# EAGLE design Base_Board_v1.1b (EAGLE 6.4)

## Sheet 1 of 3
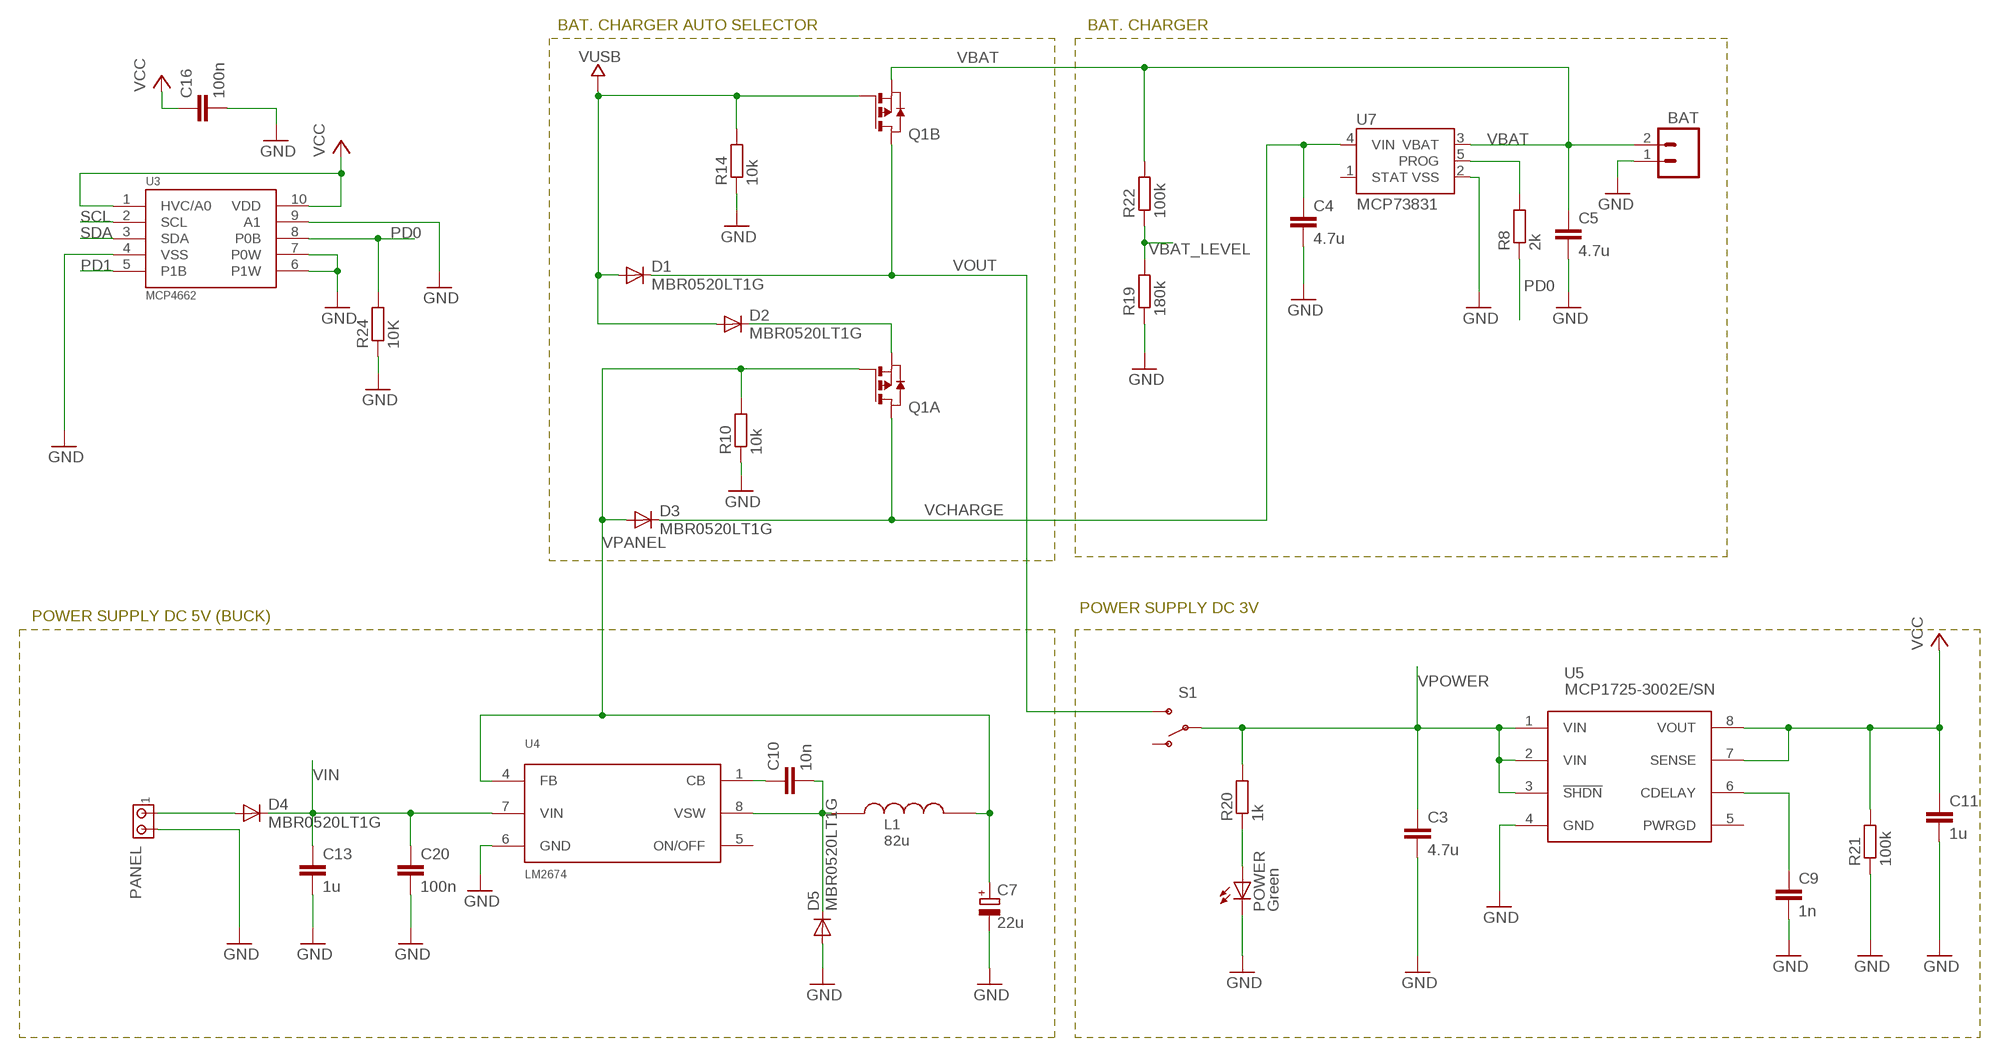
[diagram p0: schematic, sheet 1]

### Parts
BAT  M02-JST-2MM-SMT  [S2B-PH]
C3  4.7u  C-EUC0805  [C0805]
C4  4.7u  C-EUC0805  [C0805]
C5  4.7u  C-EUC0805  [C0805]
C7  22u  CPOL-EUSMCA  [SMC_A]
C9  1n  C-EUC0603K  [C0603K]
C10  10n  C-EUC0603K  [C0603K]
C11  1u  C-EUC0805  [C0805]
C13  1u  C-EUC0805  [C0805]
C16  100n  C-EUC0603K  [C0603K]
C20  100n  C-EUC0603K  [C0603K]
D1  MBR0520LT1G  DIODE-SOD123  [SOD123]
D2  MBR0520LT1G  DIODE-SOD123  [SOD123]
D3  MBR0520LT1G  DIODE-SOD123  [SOD123]
D4  MBR0520LT1G  DIODE-SOD123  [SOD123]
D5  MBR0520LT1G  DIODE-SOD123  [SOD123]
L1  82u  LSDR1006  [SDR1006]
PANEL  MTA02-100  [10X02MTA]
POWER  Green  LEDCHIP-LED0805  [CHIP-LED0805]
Q1  PMOS2SO8  [SO8]
R8  2k  R-EU_R0603  [R0603]
R10  10k  R-EU_R0603  [R0603]
R14  10k  R-EU_R0603  [R0603]
R19  180k  R-EU_R0603  [R0603]
R20  1k  R-EU_R0603  [R0603]
R21  100k  R-EU_R0603  [R0603]
R22  100k  R-EU_R0603  [R0603]
R24  10K  R-EU_R0603  [R0603]
S1  SWITCH-SPST-SMD-A  [SWITCH-SPST-SMD-A]
U3  MCP4662  [MSOP10]
U4  LM2674  [SO8]
U5  MCP1725-3002E/SN  MCP1725  [SOIC8]
U7  MCP73831  [SOT23-5]

### Nets
GND: BAT.1 C3.2 C4.2 C5.2 C7.- C9.2 C11.2 C13.2 C16.2 C20.2 D5.A PANEL.2 POWER.C R10.1 R14.1 R19.1 R21.1 R24.1 U3.4(VSS) U3.6(P1W) U3.7(P0W) U3.9(A1) U4.6(GND) U5.4(GND) U7.2(VSS) ; also sheet 2,3
N$1: D2.C Q1.1(A:S)
N$3 [power]: D4.A PANEL.1
N$9: C9.1 U5.6(CDELAY)
N$13: R8.2 U7.5(PROG)
N$20: POWER.A R20.1
N$47: C10.1 U4.1(CB)
N$54 [power]: C10.2 D5.C L1.1 U4.8(VSW)
PD0: R8.1 R24.2 U3.8(P0B)
PD1: U3.5(P1B)
SCL: U3.2(SCL) ; also sheet 2,3
SDA: U3.3(SDA) ; also sheet 2,3
VBAT [power]: BAT.2 C5.1 Q1.3(B:S) R22.2 U7.3(VBAT)
VBAT_LEVEL: R19.2 R22.1 ; also sheet 2
VCC [power]: C11.1 C16.1 R21.2 U3.1(HVC/A0) U3.10(VDD) U5.7(SENSE) U5.8(VOUT) ; also sheet 2,3
VCHARGE [power]: C4.1 D3.C Q1.7(A:D) Q1.8(A:D) U7.4(VIN)
VIN [power]: C13.1 C20.1 D4.C U4.7(VIN) ; also sheet 3
VOUT [power]: D1.C Q1.5(B:D) Q1.6(B:D) S1.3(S)
VPANEL [power]: C7.+ D3.A L1.2 Q1.2(A:G) R10.2 U4.4(FB)
VPOWER [power]: C3.1 R20.2 S1.2(P) U5.1(VIN) U5.2(VIN) U5.3(!SHDN) ; also sheet 2
VUSB [power]: D1.A D2.A Q1.4(B:G) R14.2 ; also sheet 2
Unconnected: S1.1(O) U4.5(ON/OFF) U5.5(PWRGD) U7.1(STAT)

### Notes on the sheet
- BAT. CHARGER AUTO SELECTOR | BAT. CHARGER
- POWER SUPPLY DC 3V
- POWER SUPPLY DC 5V (BUCK)

## Sheet 2 of 3
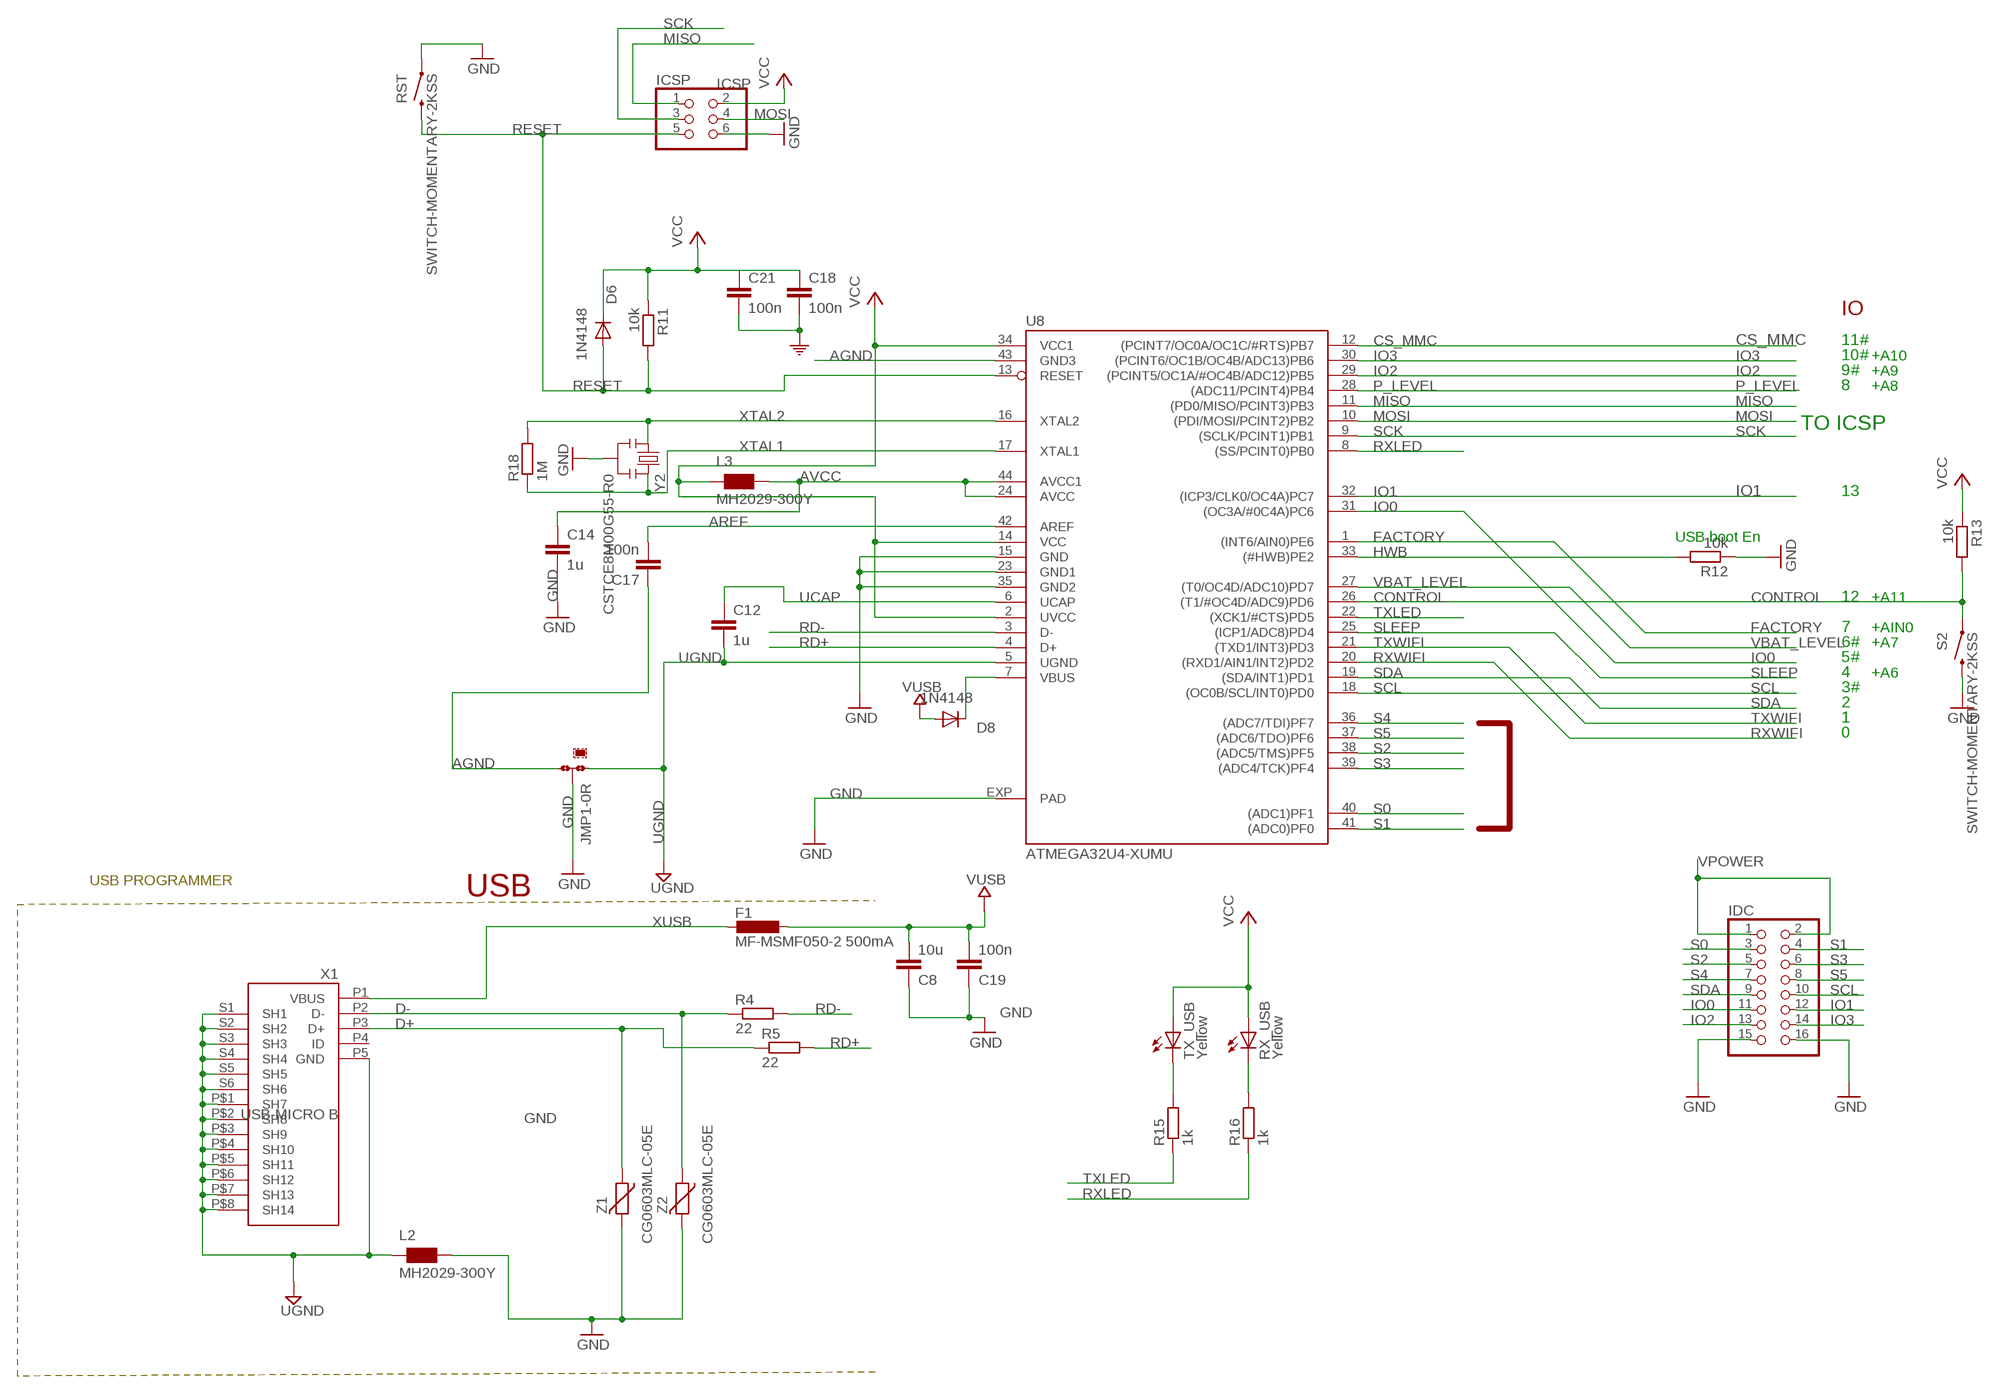
[diagram p1: schematic, sheet 2]

### Parts
C8  10u  C-EUC0805  [C0805]
C12  1u  C-EUC0805  [C0805]
C14  1u  C-EUC0805  [C0805]
C17  100n  C-EUC0603K  [C0603K]
C18  100n  C-EUC0603K  [C0603K]
C19  100n  C-EUC0603K  [C0603K]
C21  100n  C-EUC0603K  [C0603K]
D6  1N4148  DIODE-SOD323-W  [SOD323-W]
D8  1N4148  DIODE-SOD323-W  [SOD323-W]
F1  MF-MSMF050-2 500mA  L-EUL1812  [L1812]
ICSP  ICSP  PINHD-2X3  [2X03]
IDC  PINHD-2X8  [2X08]
JMP1  0R-JUMPC  [C0R-JMP]
L2  MH2029-300Y  WE-CBF_0805  [0805]
L3  MH2029-300Y  WE-CBF_0805  [0805]
R4  22  R-EU_R0603  [R0603]
R5  22  R-EU_R0603  [R0603]
R11  10k  R-EU_R0603  [R0603]
R12  10k  R-EU_R0603  [R0603]
R13  10k  R-EU_R0603  [R0603]
R15  1k  R-EU_R0603  [R0603]
R16  1k  R-EU_R0603  [R0603]
R18  1M  R-EU_R0603  [R0603]
RST  SWITCH-MOMENTARY-2KSS  [KSS241G]
RX_USB  Yellow  LEDCHIP-LED0805  [CHIP-LED0805]
S2  SWITCH-MOMENTARY-2KSS  [KSS241G]
TX_USB  Yellow  LEDCHIP-LED0805  [CHIP-LED0805]
U8  ATMEGA32U4-XUMU  [QFN44ML7X7]
X1  USB-MICRO B  MYCON2_USB-MINI-B  [CON2_USB_MICRO_B_AT]
Y2  CSTCE8M00G55-R0  [CSTCE8M00G55-R0]
Z1  CG0603MLC-05E  VARISTORCN0603  [CT/CN0603]
Z2  CG0603MLC-05E  VARISTORCN0603  [CT/CN0603]

### Nets
AGND: C17.1 JMP1.3 U8.43(GND3)
AREF [aref]: C17.2 U8.42(AREF)
AVCC: C14.1 L3.2 U8.24(AVCC) U8.44(AVCC1)
CONTROL: R13.2 S2.1 U8.26((T1/#OC4D/ADC9)PD6)
CS_MMC: U8.12((PCINT7/OC0A/OC1C/#RTS)PB7) ; also sheet 3
D+: R5.1 X1.P3(D+) Z1.1
D-: R4.1 X1.P2(D-) Z2.1
FACTORY: U8.1((INT6/AIN0)PE6) ; also sheet 3
GND: C8.1 C14.2 C18.2 C19.1 C21.2 ICSP.6 IDC.15 IDC.16 JMP1.2 L2.2 R12.1 RST.1 S2.2 U8.15(GND) U8.23(GND1) U8.35(GND2) U8.EXP(PAD) Y2.2 Z1.2 Z2.2 ; supply symbol labelled COM ; also sheet 1,3
GND1: L2.1 X1.P5(GND) X1.P$1(SH7) X1.P$2(SH8) X1.P$3(SH9) X1.P$4(SH10) X1.P$5(SH11) X1.P$6(SH12) X1.P$7(SH13) X1.P$8(SH14) X1.S1(SH1) X1.S2(SH2) X1.S3(SH3) X1.S4(SH4) X1.S5(SH5) X1.S6(SH6) ; supply symbol labelled UGND
HWB: R12.2 U8.33((#HWB)PE2)
IO0: IDC.11 U8.31((OC3A/#0C4A)PC6)
IO1: IDC.12 U8.32((ICP3/CLK0/OC4A)PC7)
IO2: IDC.13 U8.29((PCINT5/OC1A/#OC4B/ADC12)PB5)
IO3: IDC.14 U8.30((PCINT6/OC1B/OC4B/ADC13)PB6)
MISO: ICSP.1 U8.11((PD0/MISO/PCINT3)PB3) ; also sheet 3
MOSI: ICSP.4 U8.10((PDI/MOSI/PCINT2)PB2) ; also sheet 3
N$2 [usbvcc]: R15.2 TX_USB.C
N$4 [usbvcc]: R16.2 RX_USB.C
N$5 [power]: D8.C U8.7(VBUS)
P_LEVEL: U8.28((ADC11/PCINT4)PB4) ; also sheet 3
RD+: R5.2 U8.4(D+)
RD-: R4.2 U8.3(D-)
RESET: D6.A ICSP.5 R11.2 RST.2 U8.13(RESET) ; also sheet 3
RXLED: R16.1 U8.8((SS/PCINT0)PB0)
RXWIFI: U8.20((RXD1/AIN1/INT2)PD2) ; also sheet 3
S0: IDC.3 U8.40((ADC1)PF1)
S1: IDC.4 U8.41((ADC0)PF0)
S2: IDC.5 U8.38((ADC5/TMS)PF5)
S3: IDC.6 U8.39((ADC4/TCK)PF4)
S4: IDC.7 U8.36((ADC7/TDI)PF7)
S5: IDC.8 U8.37((ADC6/TDO)PF6)
SCK: ICSP.3 U8.9((SCLK/PCINT1)PB1) ; also sheet 3
SCL: IDC.10 U8.18((OC0B/SCL/INT0)PD0) ; also sheet 1,3
SDA: IDC.9 U8.19((SDA/INT1)PD1) ; also sheet 1,3
SLEEP: U8.25((ICP1/ADC8)PD4) ; also sheet 3
TXLED: R15.1 U8.22((XCK1/#CTS)PD5)
TXWIFI: U8.21((TXD1/INT3)PD3) ; also sheet 3
UCAP: C12.1 U8.6(UCAP)
UGND [gnd]: C12.2 JMP1.1 U8.5(UGND)
VBAT_LEVEL: U8.27((T0/OC4D/ADC10)PD7) ; also sheet 1
VCC [power]: C18.1 C21.1 D6.C ICSP.2 L3.1 R11.1 R13.1 RX_USB.A TX_USB.A U8.2(UVCC) U8.14(VCC) U8.34(VCC1) ; also sheet 1,3
VPOWER [power]: IDC.1 IDC.2 ; also sheet 1
VUSB [power]: C8.2 C19.2 D8.A F1.1 ; also sheet 1
XTAL1: R18.1 U8.17(XTAL1) Y2.3
XTAL2: R18.2 U8.16(XTAL2) Y2.1
XUSB [usbvcc]: F1.2 X1.P1(VBUS)
Unconnected: X1.P4(ID)

### Notes on the sheet
- IO
- 11#
- 10# | +A10
- 9# | +A9
- 8 | +A8
- TO ICSP
- 13
- USB boot En
- 12 | +A11
- 7 | +AIN0
- 6# | +A7
- 5#
- 4 | +A6
- 3#
- 2
- 1
- 0
- USB PROGRAMMER
- USB

## Sheet 3 of 3
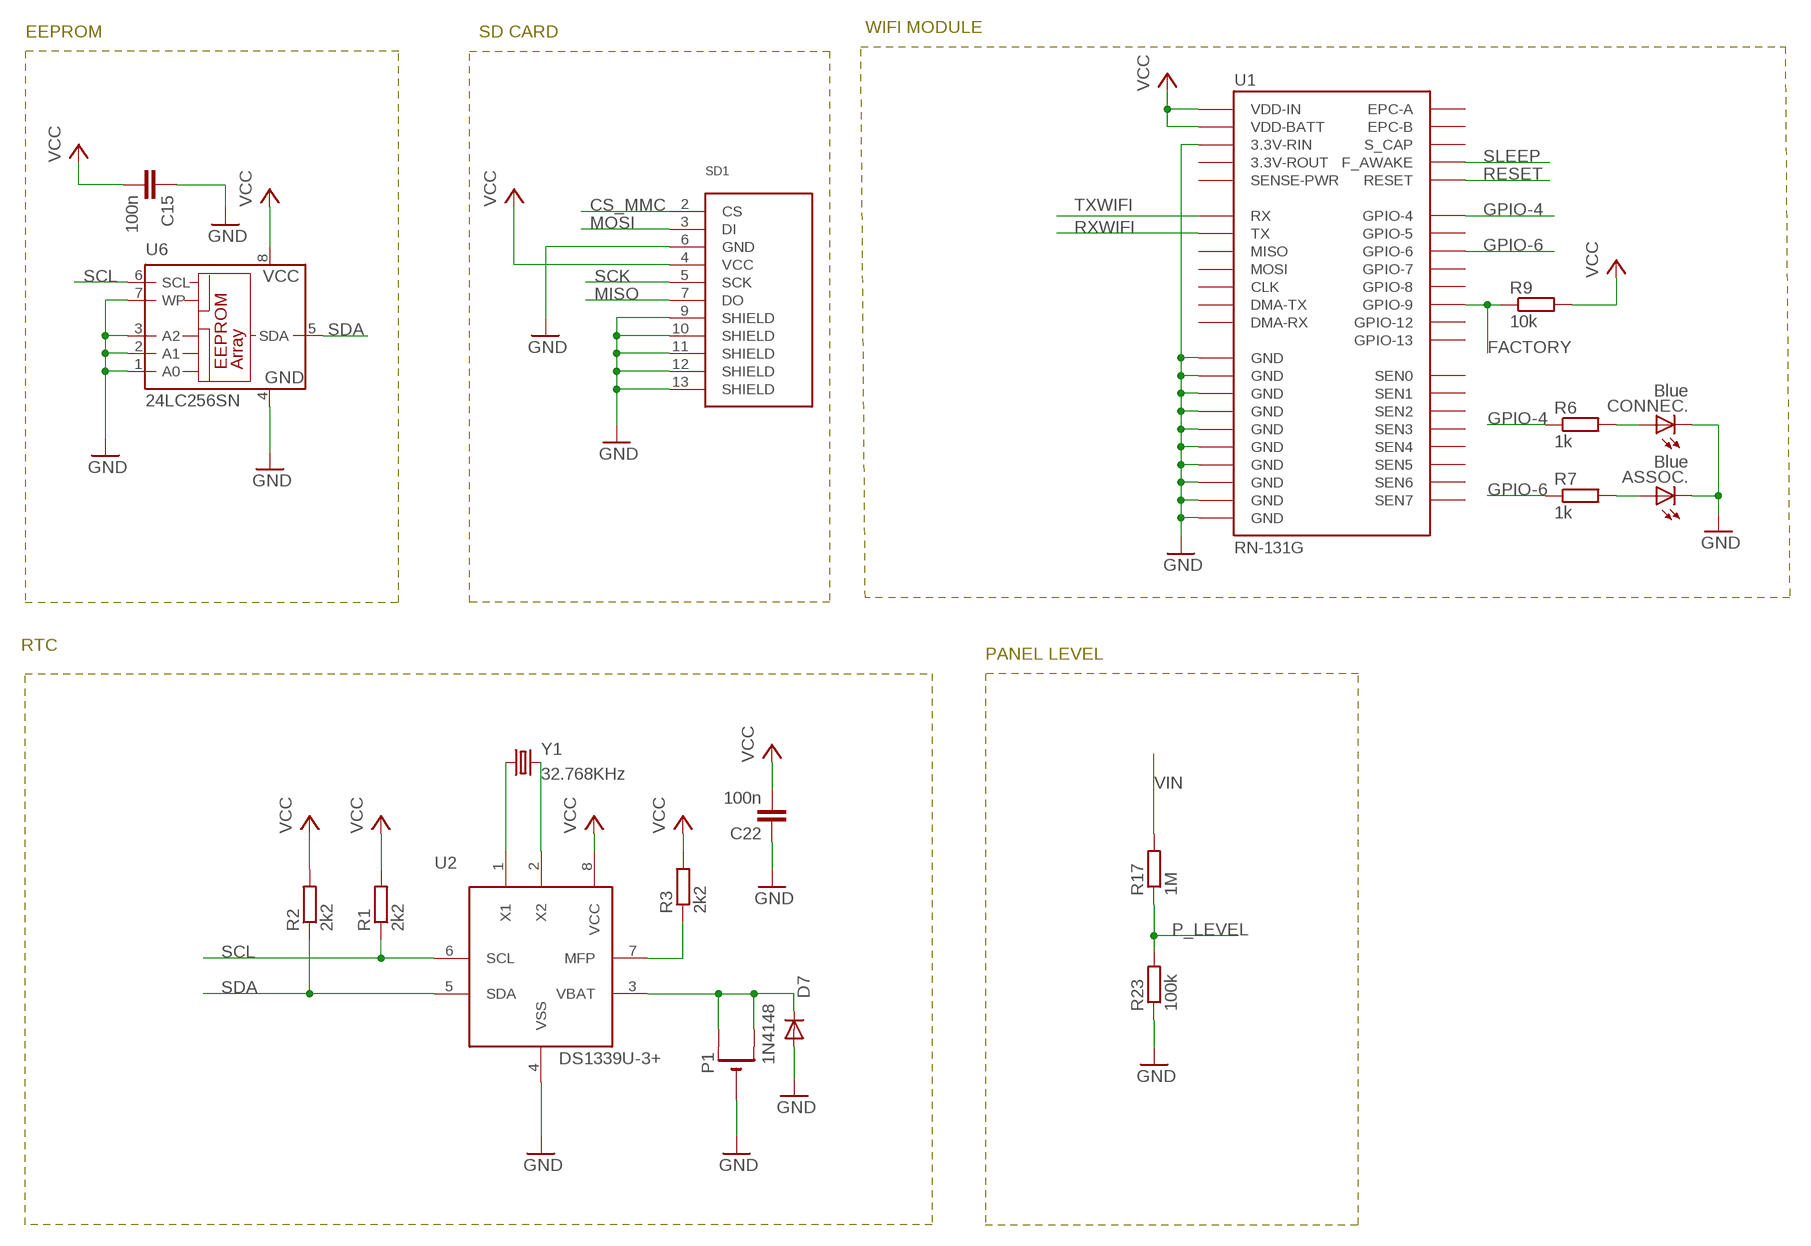
[diagram p2: schematic, sheet 3]

### Parts
ASSOC.  Blue  LEDCHIP-LED0805  [CHIP-LED0805]
C15  100n  C-EUC0603K  [C0603K]
C22  100n  C-EUC0603K  [C0603K]
CONNEC.  Blue  LEDCHIP-LED0805  [CHIP-LED0805]
D7  1N4148  DIODE-SOD323-W  [SOD323-W]
P1  CR1220SMT  [CR1220-SMD]
R1  2k2  R-EU_R0603  [R0603]
R2  2k2  R-EU_R0603  [R0603]
R3  2k2  R-EU_R0603  [R0603]
R6  1k  R-EU_R0603  [R0603]
R7  1k  R-EU_R0603  [R0603]
R9  10k  R-EU_R0603  [R0603]
R17  1M  R-EU_R0603  [R0603]
R23  100k  R-EU_R0603  [R0603]
SD1  SD_CARD_SOCKETDM3CS  [DM3CS]
U1  RN-131G  [RN-131G]
U2  DS1339U-3+  MCP7940N-I/MS  [MSOP-8]
U6  24LC256SN  [SO-08]
Y1  32.768KHz  CRYSTALABS10  [ABS10]

### Nets
CS_MMC: SD1.2(CS) ; also sheet 2
FACTORY: R9.1 U1.P$24(GPIO-9) ; also sheet 2
GND: ASSOC..C C15.1 C22.1 CONNEC..C D7.A P1.- R23.1 SD1.6(GND) SD1.9(SHIELD) SD1.10(SHIELD) SD1.11(SHIELD) SD1.12(SHIELD) SD1.13(SHIELD) U1.P$18(3.3V-RIN) U1.P$19(GND) U1.P$36(GND) U1.P$37(GND) U1.P$38(GND) U1.P$39(GND) U1.P$40(GND) U1.P$41(GND) U1.P$42(GND) U1.P$43(GND) U1.P$44(GND) U2.4(VSS) U6.1(A0) U6.2(A1) U6.3(A2) U6.4(GND) U6.7(WP) ; also sheet 1,2
GPIO-4: R6.1 U1.P$29(GPIO-4)
GPIO-6: R7.1 U1.P$27(GPIO-6)
MISO: SD1.7(DO) ; also sheet 2
MOSI: SD1.3(DI) ; also sheet 2
N$6: ASSOC..A R7.2
N$7: R3.1 U2.7(MFP)
N$8: CONNEC..A R6.2
N$16: U2.1(X1) Y1.1
N$17: U2.2(X2) Y1.2
N$18: D7.C P1.+$1(+) P1.+$2(+1) U2.3(VBAT)
P_LEVEL: R17.1 R23.2 ; also sheet 2
RESET: U1.P$5(RESET) ; also sheet 2
RXWIFI: U1.P$13(TX) ; also sheet 2
SCK: SD1.5(SCK) ; also sheet 2
SCL: R1.1 U2.6(SCL) U6.6(SCL) ; also sheet 1,2
SDA: R2.1 U2.5(SDA) U6.5(SDA) ; also sheet 1,2
SLEEP: U1.P$9(F_AWAKE) ; also sheet 2
TXWIFI: U1.P$12(RX) ; also sheet 2
VCC [power]: C15.2 C22.2 R1.2 R2.2 R3.2 R9.2 SD1.4(VCC) U1.P$20(VDD-BATT) U1.P$21(VDD-IN) U2.8(VCC) U6.8(VCC) ; also sheet 1,2
VIN [power]: R17.2 ; also sheet 1
Unconnected: U1.P$1(SEN6) U1.P$2(SEN4) U1.P$3(SEN5) U1.P$4(SEN7) U1.P$6(EPC-A) U1.P$7(EPC-B) U1.P$8(S_CAP) U1.P$10(GPIO-13) U1.P$11(GPIO-12) U1.P$14(MOSI) U1.P$15(CLK) U1.P$16(MISO) U1.P$17(3.3V-ROUT) U1.P$22(DMA-TX) U1.P$23(DMA-RX) U1.P$25(GPIO-8) U1.P$26(GPIO-7) U1.P$28(GPIO-5) U1.P$30(SEN1) U1.P$31(SEN2) U1.P$32(SEN3) U1.P$33(SENSE-PWR) U1.P$34(SEN0)

### Notes on the sheet
- EEPROM | SD CARD | WIFI MODULE
- RTC
- PANEL LEVEL

## Library data of the parts
ASSOC. CONNEC. POWER RX_USB TX_USB = led:LED: LED OSRAM: - CHIPLED LG R971, LG N971, LY N971, LG Q971, LY Q971, LO R971, LY R971 LH N974, LH R974 LS Q976, LO Q976, LY Q976 LO Q996 - Hyper CHIPLED LW Q18S LB Q993, LB Q99A, LB R99A - SideLED LS A670, LO A670, LY A670, LG A670, LP A670 LB A673, LV A673, LT A673, LW A673 LH A674 LY A675 LS A676, LA A676, LO A676, LY A676, LW A676 LS A679, LY A679, LG A679 - Hyper Micro SIDELED® LS Y876, LA Y876, LO Y876, LY Y876 LT Y87S - SmartLED LW L88C, LW L88S LB L89C, LB L89S, LG L890 LS L89K, LO L89K, LY L89K LS L896, LA L896, LO L896, LY L896 - TOPLED LS T670, LO T670, LY T670, LG T670, LP T670 LSG T670, LSP T670, LSY T670, LOP T670, LYG T670 LG T671, LOG T671, LSG T671 LB T673, LV T673, LT T673, LW T673 LH T674 LS T676, LA T676, LO T676, LY T676, LB T676, LH T676, LSB T676, LW T676 LB T67C, LV T67C, LT T67C, LS T67K, LO T67K, LY T67K, LW E67C LS E67B, LA E67B, LO E67B, LY E67B, LB E67C, LV E67C, LT E67C LW T67C LS T679, LY T679, LG T679 LS T770, LO T770, LY T770, LG T770, LP T770 LB T773, LV T773, LT T773, LW T773 LH T774 LS E675, LA E675, LY E675, LS T675 LS T776, LA T776, LO T776, LY T776, LB T776 LHGB T686 LT T68C, LB T68C - Hyper Mini TOPLED® LB M676 - Mini TOPLED Santana® LG M470 LS M47K, LO M47K, LY M47K Source: http://www.osram.convergy.de LUXEON: - LUMILED® LXK2-PW12-R00, LXK2-PW12-S00, LXK2-PW14-U00, LXK2-PW14-V00 LXK2-PM12-R00, LXK2-PM12-S00, LXK2-PM14-U00 LXK2-PE12-Q00, LXK2-PE12-R00, LXK2-PE12-S00, LXK2-PE14-T00, LXK2-PE14-U00 LXK2-PB12-K00, LXK2-PB12-L00, LXK2-PB12-M00, LXK2-PB14-N00, LXK2-PB14-P00, LXK2-PB14-Q00 LXK2-PR12-L00, LXK2-PR12-M00, LXK2-PR14-Q00, LXK2-PR14-R00 LXK2-PD12-Q00, LXK2-PD12-R00, LXK2-PD12-S00 LXK2-PH12-R00, LXK2-PH12-S00 LXK2-PL12-P00, LXK2-PL12-Q00, LXK2-PL12-R00 Source: www.luxeon.com KINGBRIGHT: KA-3528ASYC Source: www.kingbright.com
BAT = SparkFun:M02: Header 2 Standard 2-pin 0.1" header. Use with straight break away headers (SKU : PRT-00116), right angle break away headers (PRT-00553), swiss pins (PRT-00743), machine pins (PRT-00117), and female headers (PRT-00115). Molex polarized connector foot print use with SKU : PRT-08233 with associated crimp pins and housings.
C3-C5 C9-C11 C13 C15 C16 C20 C22 = rcl:C-EU: CAPACITOR, European symbol
C7 = rcl:CPOL-EU: POLARIZED CAPACITOR, European symbol
C8 C12 C14 C17-C19 C21 = SmartPrj:C-EU: CAPACITOR, European symbol
D1-D8 = diode:DIODE-: DIODE
F1 = rcl:L-EU: INDUCTOR, European symbol
ICSP = SmartPrj:PINHD-2X3: PIN HEADER
IDC = pinhead:PINHD-2X8: PIN HEADER
JMP1 = Hangar:0R-JUMP: SMD 0R 0805 Jumper
L1 = Hangar:L
L2 L3 = wuerth-elektronik:WE-CBF: SMD EMI Suppression Ferrite Beads - excellent anti-EMI properties - low DCR - impedances till 3000 ohms - rated current up to 6 A
P1 = adafruit:CR1220: CR1216/CR1220/CR1225 12mm 3V lithium coin cell Great for battery packup. Both SMT and THM holders. Note the THM package has the ground pads on both sides of the PCB so that the masks are the same - this reduces the cost
PANEL = con-amp:MTA02-100: AMP connector
Q1 = zetex:PMOS2: DUAL 30V P-CHANNEL ENHANCEMENT MODE MOSFET Source: Data sheet <http://www.diodes.com/datasheets/ZXMP3A16DN8.pdf> SOP8 Source: Data sheet <http://www.diodes.com/datasheets/ZXMD63P03X.pdf> MSOP8; OC_FARNELL: unknown; OC_NEWARK: unknown
R1-R24 = rcl:R-EU_: RESISTOR, European symbol
RST S2 = Hangar:SWITCH-MOMENTARY-2
S1 = SparkFun 13-1-2012:SWITCH-SPST: SPST Switch Simple slide switch. Spark Fun Electronics SKU : COM-00102
SD1 = Hangar:SD_CARD_SOCKET: SD/MMC Socket Media socket for SD and MMC cards. Push-push type. Model MOLEX 503182-0853
U1 = SparkFun:RN-131G: Roving Netowrks WiFLy GSX Module
U2 = Hangar:MCP7940N
U3 = Hangar:MCP4662
U4 = Hangar:LM2674
U5 = Hangar:MCP1725
U6 = microchip:24*: Serial EEPROM I2C; MF: MICROCHIP; MPN: 24LC256-I/SN; OC_FARNELL: 9757996; OC_NEWARK: 27C9144
U7 = SparkFun-PowerIC:MCP73831: Miniature single cell, fully integrated Li-Ion, Li-polymer charge management controller http://ww1.microchip.com/downloads/en/DeviceDoc/21984a.pdf
U8 = SmartPrj:ATMEGA32U4-XU
X1 = SmartPrj:MYCON2_USB-MINI-B
Y1 = Hangar:CRYSTAL: CRYSTAL
Y2 = Hangar:CSTCE8M00G55-R0
Z1 Z2 = varistor:VARISTOR: VARISTOR

## Net classes
0 default: width 0.203 mm, drill 0.305 mm, clearance 0.203 mm
1 power: width 0.406 mm, drill 0.6 mm, clearance 0.203 mm
2 gnd: width 0.254 mm, drill 0.6 mm, clearance 0.203 mm
3 usbvcc: width 0.254 mm, drill 0.6 mm, clearance 0.203 mm
4 aref: width 0.254 mm, drill 0.6 mm, clearance 0.203 mm

## Board
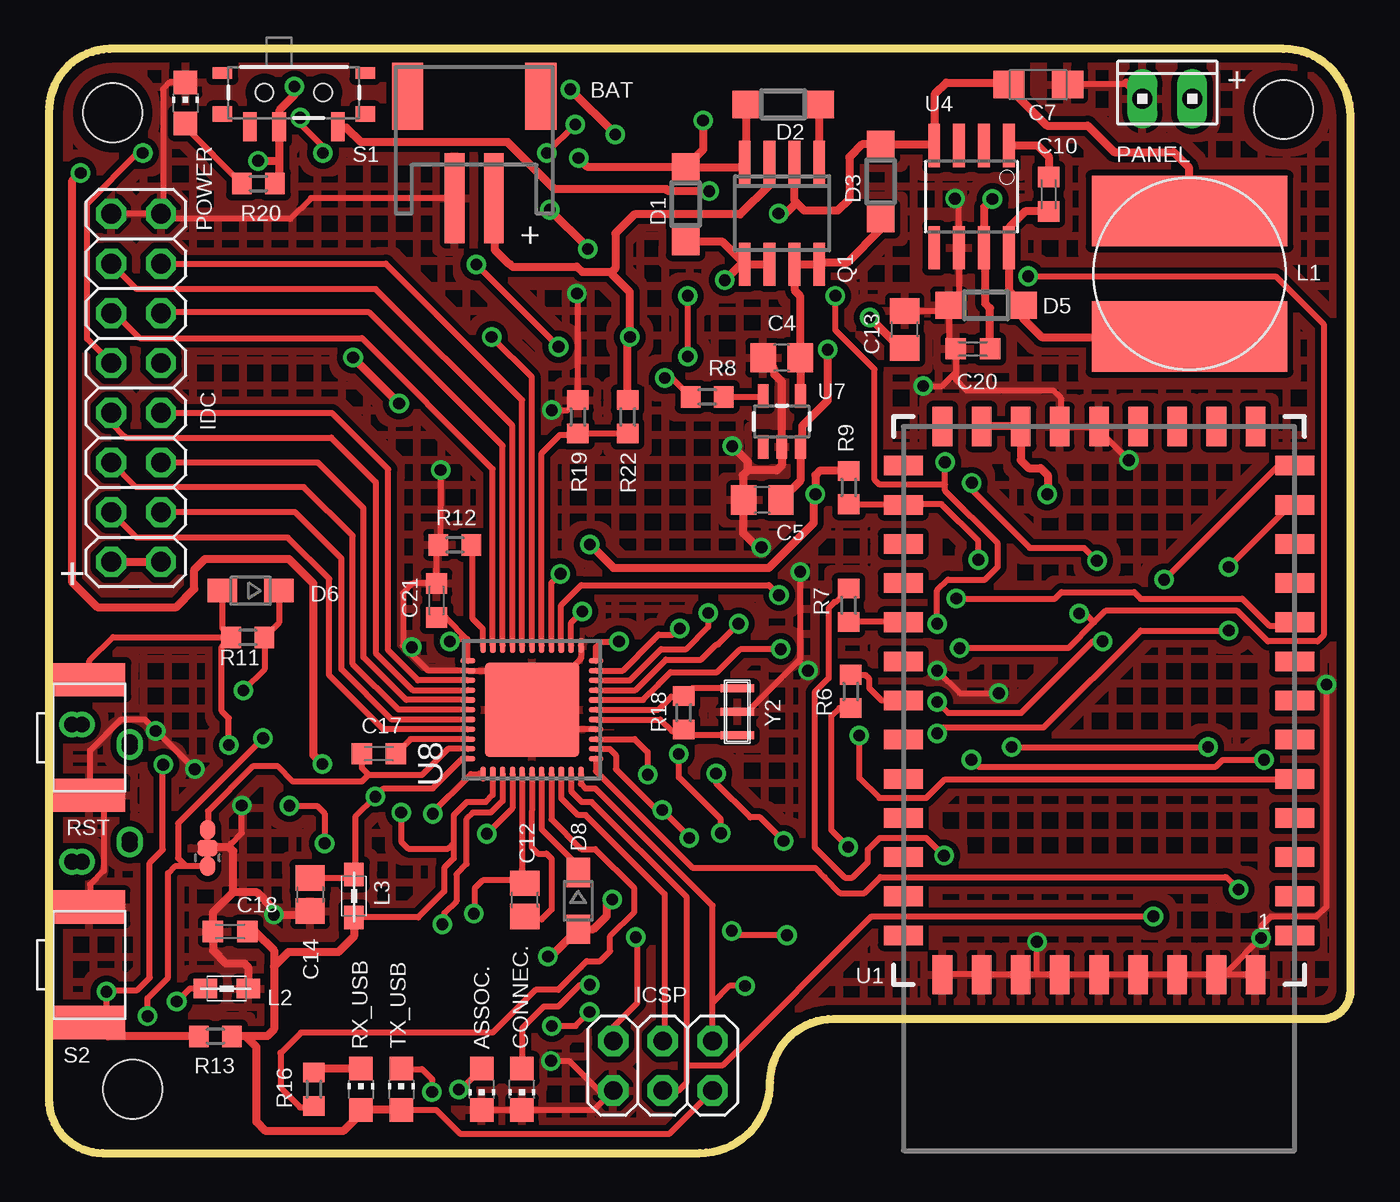
[diagram p3: board, top side]
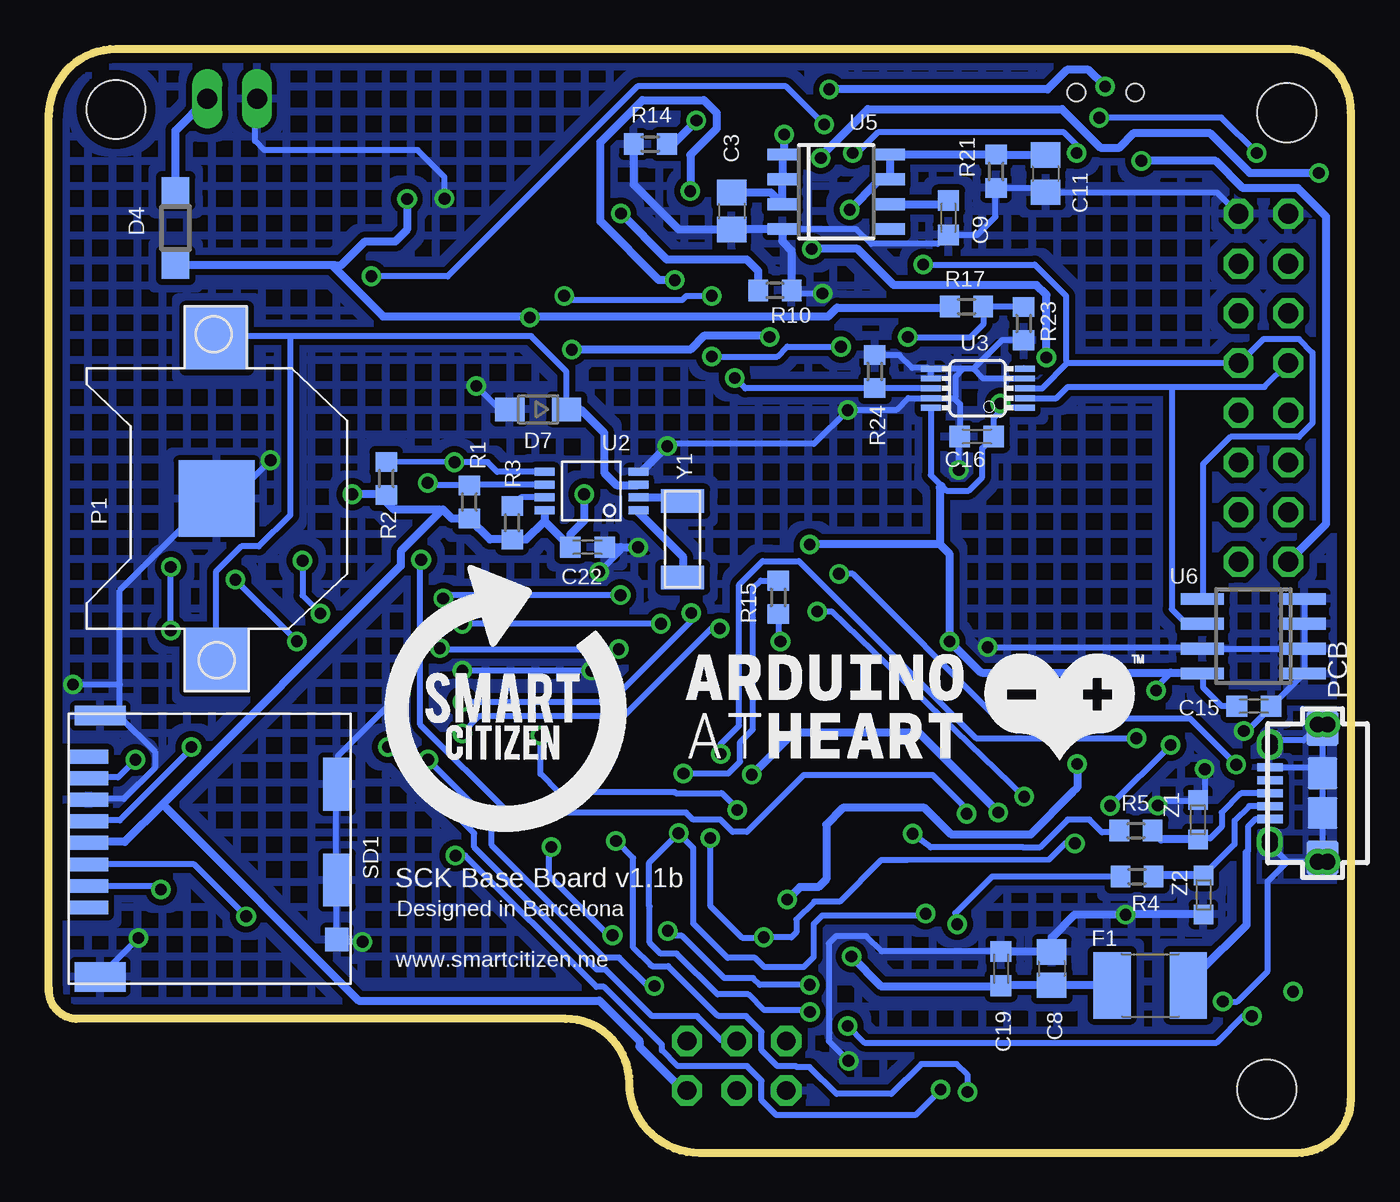
[diagram p4: board, bottom side, seen from below]

Size 66.52 x 56.41 mm. Coordinates in mm from the lower left corner, seen from the top.
Outline: 2.74,0 33.26,0 arc90 36.86,3.6 arc-90 40.12,6.86 65.15,6.86 arc90 66.52,8.4 66.52,52.98 arc90 63.09,56.41 3.09,56.41 arc90 0,53.15 0,2.74 arc90 2.74,0
Copper layers (1*16): Top 0.035mm / dielectric 1.5mm / Bottom 0.035mm
Design rules "default": minimum track width 12mil, minimum drill 0.6mm, track to track 12mil, track to pad 12mil, pad to pad 8mil, via to via 6mil, smd to smd 8mil, copper to edge 20mil, drill to drill 1mm, minimum pad ring 10mil, minimum via ring 0.2mm, stop-mask expansion 4mil, vias tented up to drill 0mil, thermal gap 10mil
Holes 3 mm at 3.26,53.15 4.29,3.26 63.09,53.32

### Footprints (pad centres in the part's own frame; a part is rotated, then mirrored left to right if it is on the bottom)
CHIP-LED0805 = smd 1.2 x 1.2: A 0,-1.05; C 0,1.05
S2B-PH = smd 1 x 4.6: 1 -1,-3.7; 2 1,-3.7 | smd 1.6 x 3.4: NC1 -3.4,1.5; NC2 3.4,1.5
C0805 = smd 1.3 x 1.5: 1 -0.95,0; 2 0.95,0
SMC_A = smd 1.6 x 1.4: + -1.5,0; - 1.5,0
C0805' = smd 1.3 x 1.5: 1 -0.85,0; 2 0.85,0
C0603K = smd 1.05 x 1.08: 1 -0.875,0; 2 0.875,0
SOD123 = smd 1.4 x 1.4: A 1.9,0; C -1.9,0
SOD323-W = smd 1.5 x 1.2: A 1.45,0; C -1.45,0
L1812 = smd 1.9 x 3.4: 1 -1.95,0; 2 1.95,0
2X03 = drill 0.95 pad 1.55 octagon: 1 -2.54,-1.27; 2 -2.54,1.27; 3 0,-1.27; 4 0,1.27; 5 2.54,-1.27; 6 2.54,1.27
2X08 = drill 1.016 octagon: 1 -8.89,-1.27; 2 -8.89,1.27; 3 -6.35,-1.27; 4 -6.35,1.27; 5 -3.81,-1.27; 6 -3.81,1.27; 7 -1.27,-1.27; 8 -1.27,1.27; 9 1.27,-1.27; 10 1.27,1.27; 11 3.81,-1.27; 12 3.81,1.27; 13 6.35,-1.27; 14 6.35,1.27; 15 8.89,-1.27; 16 8.89,1.27
C0R-JMP = smd 0.8 x 1: 1 0,0.938; 3 0,-0.938 | smd 1 x 0.8: 2 0,0
SDR1006 = smd 10 x 3.6: 1 0,3.2; 2 0,-3.2
0805 = smd 1.2 x 1: 1 -1.1,0; 2 1.1,0
CR1220-SMD = smd 3.2 x 3.2: +$1 -8.2,0; +$2 8.2,0 | smd 3.9 x 3.9: - 0,0
10X02MTA = drill 1.016 long: 1 1.27,0; 2 -1.27,0
SO8 = smd 0.6 x 2.2: 1 -1.905,-2.6; 2 -0.635,-2.6; 3 0.635,-2.6; 4 1.905,-2.6; 5 1.905,2.6; 6 0.635,2.6; 7 -0.635,2.6; 8 -1.905,2.6
R0603 = smd 1 x 1.1: 1 -0.85,0; 2 0.85,0
KSS241G = smd 1.7 x 3.7: 1 -2.95,0; 2 2.95,0
SWITCH-SPST-SMD-A = smd 0.7 x 1.5: 1 -2.25,-1.75; 2 -0.75,-1.75; 3 2.25,-1.75 | smd 1 x 0.6: GND1 -3.65,1; GND3 3.65,1 | smd 1 x 0.8: GND2 -3.65,-1.1; GND4 3.65,-1.1 | hole 0.9: -1.5,0; 1.5,0
DM3CS = smd 0.7 x 2: 1 2.54,-5.35; 2 1.44,-5.35; 3 0.34,-5.35; 4 -0.76,-5.35; 5 -1.86,-5.35; 6 -2.96,-5.35; 7 -4.06,-5.35; 8 -5.16,-5.35 | smd 1 x 2.6: 9 -7.26,-4.75 | smd 2.7 x 1.4: 10 -3.76,7.35; 11 1.14,7.35 | smd 1.2 x 1.2: 12 4.19,7.35 | smd 1.5 x 2.6: 13 6.09,-4.75
RN-131G = smd 2 x 1: P$1 -10,11; P$2 -10,9; P$3 -10,7; P$4 -10,5; P$5 -10,3; P$6 -10,1; P$7 -10,-1; P$8 -10,-3; P$9 -10,-5; P$10 -10,-7; P$11 -10,-9; P$12 -10,-11; P$13 -10,-13; P$23 10,-13; P$24 10,-11; P$25 10,-9; P$26 10,-7; P$27 10,-5; P$28 10,-3; P$29 10,-1; P$30 10,1; P$31 10,3; P$32 10,5; P$33 10,7; P$34 10,9; P$35 10,11 | smd 1 x 2: P$14 -8,-15; P$15 -6,-15; P$16 -4,-15; P$17 -2,-15; P$18 0,-15; P$19 2,-15; P$20 4,-15; P$21 6,-15; P$22 8,-15; P$36 8,13; P$37 6,13; P$38 4,13; P$39 2,13; P$40 0,13; P$41 -2,13; P$42 -4,13; P$43 -6,13; P$44 -8,13
MSOP-8 = smd 0.41 x 1.02: 1 -0.975,-2.4; 2 -0.325,-2.4; 3 0.325,-2.4; 4 0.975,-2.4; 5 0.975,2.4; 6 0.325,2.4; 7 -0.325,2.4; 8 -0.975,2.4
MSOP10 = smd 0.3 x 1.02: 1 -1,-2.4; 2 -0.5,-2.4; 3 0,-2.4; 4 0.5,-2.4; 5 1,-2.4; 6 1,2.4; 7 0.5,2.4; 8 0,2.4; 9 -0.5,2.4; 10 -1,2.4
SO8' = smd 0.61 x 2.21: 1 -1.905,-2.616; 2 -0.635,-2.616; 3 0.635,-2.616; 4 1.905,-2.616; 5 1.905,2.616; 6 0.635,2.616; 7 -0.635,2.616; 8 -1.905,2.616
SOIC8 = smd 0.6 x 1.5: 1 -1.905,-2.75; 2 -0.635,-2.75; 3 0.635,-2.75; 4 1.905,-2.75; 5 1.905,2.75; 6 0.635,2.75; 7 -0.635,2.75; 8 -1.905,2.75
SO-08 = smd 0.6 x 2.2: 1 -1.905,-2.6; 2 -0.635,-2.6; 3 0.635,-2.6; 4 1.905,-2.6; 5 1.905,2.6; 6 0.635,2.6; 7 -0.635,2.6; 8 -1.905,2.6
SOT23-5 = smd 0.55 x 1.2: 1 -0.95,-1.3; 2 0,-1.3; 3 0.95,-1.3; 4 0.95,1.3; 5 -0.95,1.3
QFN44ML7X7 = smd 0.75 x 0.275: 1 -3.275,2.5; 2 -3.275,2; 3 -3.275,1.5; 4 -3.275,1; 5 -3.275,0.5; 6 -3.275,0; 7 -3.275,-0.5; 8 -3.275,-1; 9 -3.275,-1.5; 10 -3.275,-2; 11 -3.275,-2.5; 23 3.275,-2.5; 24 3.275,-2; 25 3.275,-1.5; 26 3.275,-1; 27 3.275,-0.5; 28 3.275,0; 29 3.275,0.5; 30 3.275,1; 31 3.275,1.5; 32 3.275,2; 33 3.275,2.5 | smd 0.275 x 0.75: 12 -2.5,-3.275; 13 -2,-3.275; 14 -1.5,-3.275; 15 -1,-3.275; 16 -0.5,-3.275; 17 0,-3.275; 18 0.5,-3.275; 19 1,-3.275; 20 1.5,-3.275; 21 2,-3.275; 22 2.5,-3.275; 34 2.5,3.275; 35 2,3.275; 36 1.5,3.275; 37 1,3.275; 38 0.5,3.275; 39 0,3.275; 40 -0.5,3.275; 41 -1,3.275; 42 -1.5,3.275; 43 -2,3.275; 44 -2.5,3.275 | smd 4.826 x 4.826: EXP 0,0
CON2_USB_MICRO_B_AT = smd 0.406 x 1.346: P1 -1.321,2.692; P2 -0.66,2.692; P3 0,2.692; P4 0.66,2.692; P5 1.321,2.692 | drill 0.8 pad 1.27: P$1 -2.616,2.692 | drill 0.8 pad 1.245: P$2 -2.362,2.692; P$7 2.362,2.692; P$8 2.616,2.692 | drill 0.8 pad 1.143: P$3 -3.505,-0.254; P$4 -3.505,0.254; P$5 3.505,0.254; P$6 3.505,-0.254 | smd 1.778 x 1.651: S1 -3.302,0; S2 3.302,0 | smd 1.524 x 1.27: S3 -2.489,2.692; S4 2.489,2.692 | smd 1.626 x 1.524: S5 -1.016,0; S6 1.016,0
ABS10 = smd 1.2 x 2.2: 1 -1.9,-0.05; 2 2,-0.05
CSTCE8M00G55-R0 = smd 0.4 x 1.7: 1 -1.2,0; 2 0,0; 3 1.2,0
CT/CN0603 = smd 1 x 1: 1 -1,0; 2 1,0

### Placement (x,y rotation side)
ASSOC.  22.12,3.26 180 top
BAT  21.73,52.49 0 top
C3  31.63,48.12 270 bottom
C4  37.45,40.63 180 top
C5  36.46,33.36 180 top
C7  50.56,54.58 0 top
C8  10u  [C0805']  15.27,9.42 270 bottom
C9  20.56,47.78 270 bottom
C10  51.09,48.98 270 top
C11  15.58,50.03 270 bottom
C12  1u  [C0805']  24.32,12.93 90 top
C13  43.74,42.08 90 top
C14  1u  [C0805']  13.35,13.21 270 top
C15  4.94,22.83 180 bottom
C16  19.11,36.61 180 bottom
C17  16.86,20.4 0 top
C18  9.26,11.32 180 top
C19  17.86,9.42 270 bottom
C20  47.22,41.08 180 top
C21  19.81,28.23 90 top
C22  39,30.95 180 bottom
CONNEC.  24.17,3.26 180 top
D1  32.54,48.47 90 top
D2  37.52,53.57 180 top
D3  42.51,49.63 90 top
D4  60.05,47.26 90 bottom
D5  47.9,43.31 180 top
D6  10.31,28.73 180 top
D7  41.52,37.99 180 bottom
D8  27.05,12.89 270 top
F1  10.24,8.56 0 bottom
ICSP  31.38,4.46 180 top
IDC  4.46,39.09 90 top
JMP1  8.1,15.58 180 top
L1  58.29,44.92 180 top
L2  9.09,8.4 0 top
L3  15.59,13.13 90 top
P1  57.95,33.43 90 bottom
PANEL  57.16,53.86 0 top
POWER  6.98,53.65 0 top
Q1  37.47,48.01 180 top
R1  45.04,33.26 270 bottom
R2  49.29,34.46 270 bottom
R3  42.85,32.2 270 bottom
R4  10.91,14.13 180 bottom
R5  10.97,16.47 180 bottom
R6  40.98,23.58 270 top
R7  40.87,27.99 90 top
R8  33.64,38.63 0 top
R9  40.88,34 90 top
R10  29.42,44.07 180 bottom
R11  10.16,26.35 180 top
R12  20.75,31.07 0 top
R13  8.51,5.97 180 top
R14  35.79,51.54 0 bottom
R15  29.25,28.39 90 bottom
R16  13.54,3.26 90 top
R17  19.63,43.24 180 bottom
R18  32.44,22.49 270 top
R19  27.04,37.61 270 top
R20  10.7,49.52 0 top
R21  18.12,50.15 90 bottom
R22  29.58,37.61 90 top
R23  16.7,42.37 90 bottom
R24  24.31,39.93 270 bottom
RST  2.06,21.23 90 top
RX_USB  15.94,3.26 0 top
S1  12.52,54.18 0 top
S2  2.06,9.61 90 top
SD1  59.15,15.09 270 bottom
TX_USB  18,3.26 0 top
U1  53.66,22.12 180 top
U2  38.8,33.82 90 bottom
U3  19.06,39.07 90 bottom
U4  LM2674  [SO8']  47.15,48.86 180 top
U5  26.29,49.11 270 bottom
U6  4.97,26.4 90 bottom
U7  37.45,37.37 0 top
U8  24.69,22.65 90 top
X1  1.43,18.38 90 bottom
Y1  34.19,31.31 90 bottom
Y2  35.18,22.54 90 top
Z1  7.8,17.03 90 bottom
Z2  7.52,13.19 270 bottom

### Tracks (layer width: path | path; a pad name or v marks a point on that pad's centre or on a via)
AGND
  Top 0.305: U8.43 20.39,20.65 19.07,19.32 16.34,19.32 | JMP1.3 8.13,16.54 8.13,17.47 10.41,19.75 11.7,19.75 12.47,18.99 16.01,18.99 16.34,19.32 | C17.1 15.98,19.68 16.34,19.32
AREF
  Top 0.305: U8.42 18.48,21.15 C17.2
AVCC  (via drill 0.6)
  Top 0.305: C14.1 15.42,14.06 L3.2 15.66,14.3 15.66,17.18 v16.69,18.21 17.12,18.64 19.61,18.64 21.12,20.15 U8.44 | U8.24 26.69,27.09 v27.26,27.67
  Bottom 0.305: v27.26,27.67 26.53,27.67 v16.69,18.21
CONTROL  (via drill 0.6)
  Top 0.305: U8.26 25.69,29.13 v26.15,29.59 | S2.1 2.95,6.29 v2.95,8.24 3.03,8.33 4.52,8.33 5.15,8.97 5.15,14.84 5.82,15.5 5.82,19.81 v5.85,19.84
  Top 0.406: R13.2 3.01,5.97 S2.1
  Bottom 0.305: v26.15,29.59 25.45,29.59 18.05,22.19 8.2,22.19 v5.85,19.84
CS_MMC  (via drill 0.6)
  Top 0.305: U8.12 27.96,19.52 32.89,14.58 39.17,14.56 39.64,14.09 39.64,14.08 40.44,13.28 41.68,13.28 42.48,14.09 60.12,14.09 60.14,14.11 v60.79,13.46
  Bottom 0.305: SD1.2 60.98,13.65 v60.79,13.46
D+
  Bottom 0.305: X1.P3 5.6,18.37 6.58,17.4 6.58,16.67 7.17,16.08 7.45,16.09 Z1.1
  Bottom 0.406: Z1.1 9.68,16.03 R5.1
D-
  Bottom 0.305: X1.P2 5.19,17.72 5.93,16.98 5.93,15.77 Z2.1
  Bottom 0.406: Z2.1 10,14.19 R4.1
FACTORY  (via drill 0.6)
  Top 0.305: 21.96,19.37 U8.1 21.57,19.36 19.47,17.26 v19.62,17.33 | v47.5,30.31 47.5,31.27 45.62,33.16 43.7,33.16 U1.P$24 40.91,33.12 R9.1
  Bottom 0.305: v47.5,30.31 47.54,30.27 47.54,21.89 43.04,17.39 33.96,17.39 33.6,17.03 32.21,17.03 32.1,16.92 | 32.1,16.92 31.59,16.41 30.86,16.41 27.95,19.31 21.35,19.31 19.84,17.81 19.84,17.56 v19.62,17.33 | 32.1,16.92
GND  (via drill 0.6)
  Top 0.305: U8.EXP 22.69,24.65 U8.35 19.38,24.65 18.37,25.66 | U8.23 27.19,25.26 25.89,23.97 25.89,23.85 U8.EXP | U8.15 25.69,21.65 U8.EXP | v20.02,34.89 20,31.17 R12.1 19.81,30.98 C21.2 18.59,29.1 18.1,28.6 18.1,25.93 18.37,25.66 | POWER.C 6.18,54.7 5.83,54.35 5.83,48.08 IDC.15 | IDC.15 IDC.16 | BAT.1 13.4,48.79 12.34,47.73 5.98,47.73 IDC.15 | ASSOC..C CONNEC..C 27.86,2.21 28.47,2.82 | 28.47,2.82 ICSP.6 | 11.39,12.29 v11.5,12.18 | C13.2 45.71,43.03 D5.A | D5.A 46,41.42 C20.2 46.34,39.89 | 46.34,39.89 46.34,39.52 46.9,38.97 51.32,38.97 51.71,38.58 51.71,37.16 U1.P$19 U1.P$18 53.6,36.99 v55.2,35.39 | v44.68,39.18 45.64,39.18 46.34,39.89 | D5.A 46.51,43.83 U4.6 46.51,48.55 v46.31,48.76 | v25.7,37.95 26.53,37.95 R19.1 27.04,43.86 v26.99,43.91 | U1.P$36 45.7,9.14 47.65,9.14 U1.P$37 47.8,9.14 49.65,9.14 U1.P$38 49.8,9.14 50.5,9.14 | 50.5,9.14 51.65,9.14 U1.P$39 51.8,9.14 53.65,9.14 U1.P$40 53.8,9.14 55.65,9.14 U1.P$41 55.8,9.14 57.65,9.14 U1.P$42 57.8,9.14 59.65,9.14 U1.P$43 59.8,9.14 60.25,9.14 | 60.25,9.14 61.65,9.14 U1.P$44 | 60.25,9.14 60.25,9.29 v61.95,10.99 62,11.14 62,11.64 62.45,12.09 64.8,12.09 65.3,12.59 v65.3,23.94 | 50.5,9.14 v50.5,10.79 | 38.3,25.14 38.4,25.24 v38.4,29.69 | 38.3,25.14 35.75,22.59 35.2,22.59 Y2.2 | 18.37,25.66 v18.55,25.84 | v48.55,23.49 46.55,23.49 v45.4,24.64 | 38.3,25.14 v38.8,24.64 | v25.66,4.71 26.58,4.71 28.47,2.82 | v9.86,17.76 9.86,16.36 9.31,15.81 9.21,15.63 | 5.48,21.59 4.91,22.16 3.71,22.16 2.11,20.56 2.11,18.31 RST.1 2.16,18.16 2.81,17.51 2.81,14.41 2.11,13.71 2.11,12.61 S2.2 | 5.48,21.59 v7.46,19.61 | C7.- 52.11,54.61 54.91,54.61 55.06,54.69
  Top 0.305: v5.46,21.56 5.48,21.59
  Top 0.406: 9.42,13.33 8.38,12.29 C18.2 8.38,10.35 9.04,9.69 9.98,9.69 10.18,9.5 L2.2 | 9.42,13.33 9.42,15.42 9.21,15.63 8.15,15.63 JMP1.2 | v11.5,12.18 13.17,12.18 C14.2 | 55.06,54.69 PANEL.2 | C4.2 37.08,40.06 37.08,39.79 37.45,39.41 U7.2 37.45,35.13 37.2,34.87 35.72,34.87 | 35.72,34.87 35.47,34.63 35.47,33.41 C5.2 35.49,33.34 35.49,31.66 36.21,30.95 v36.41,30.95 | 35.72,34.87 35.72,35.32 v34.93,36.11 | 11.39,12.29 11.39,12.57 10.64,13.31 9.43,13.31 9.42,13.33
  Bottom 0.305: U3.4 18.79,39.57 19.28,40.06 | 19.28,40.06 19.8,40.06 | 19.8,40.06 U3.6 | U3.7 U3.6 | U3.9 20.27,38.57 19.96,38.26 19.96,36.63 | 19.96,36.63 C16.2 | U3.9 20.27,38.57 20.18,38.66 20.18,39.68 19.8,40.06 | 19.96,36.63 20.08,36.57 v20.02,34.89 | U6.4 U6.3 U6.2 | U6.2 U6.1 2.4,24.5 C15.1 4.16,22.71 5.31,21.56 v5.46,21.56 | U6.2 U6.7 7.7,25.84 v18.55,25.84 | IDC.15 6.83,49.09 C11.2 15.8,49.3 R21.1 18.15,49.28 18.15,47.84 19.08,46.91 C9.2 20.7,46.84 21.1,46.44 24.5,46.44 25.25,47.19 28.85,47.19 U5.4 | 28.66,3.01 ICSP.6 | D7.A 43.49,37.99 v44.68,39.18 | v46.31,48.76 46.31,49.86 47.68,51.24 55.51,51.24 55.99,51.72 55.99,53.75 PANEL.2 | v26.99,43.91 28.4,43.91 R10.1 | SD1.6 64.5,18.09 62.7,18.09 61.1,19.69 61.1,20.49 62.95,22.34 SD1.9 62.9,22.49 62.9,23.94 | 62.9,23.94 62.9,28.74 58.25,33.39 58,33.39 P1.- 57.85,33.54 57.05,33.54 v55.2,35.39 | v61.95,10.99 63.9,9.04 SD1.13 | v50.5,10.79 51.7,10.79 SD1.12 51.85,10.94 51.85,13.94 SD1.11 51.85,14.09 51.85,18.84 SD1.10 51.75,18.99 51.75,20.29 v48.55,23.49 | v65.3,23.94 62.9,23.94 | v38.4,29.69 37.3,30.79 37.3,30.96 | v38.8,24.64 v45.4,24.64 | v25.66,4.71 26.67,5.72 26.67,10.71 26.29,11.09 24.75,11.09 23.96,10.3 C19.1 | 25.67,37.98 27.43,36.23 34.81,36.23 v34.93,36.11 | 25.67,37.98 23.2,37.98 22.61,38.57 U3.9 | U3.9 | R23.1 17.82,41.52 18.53,40.81 18.54,40.81 19.28,40.06 | v9.86,17.76 9.61,18.01 7.56,18.01 Z1.2 7.46,18.16 v7.46,19.61 | R24.1 24.31,40.76 23.06,40.76 22.41,40.11 21.61,40.11 U3.6 | v25.7,37.95 v25.71,37.96 25.67,37.98
  Bottom 0.406: Z2.2 11.39,12.19 v11.5,12.18 v11.51,12.19 14.09,12.19 15.27,11.01 C8.1 17.84,10.27 C19.1 | U2.4 36.24,34.8 v34.93,36.11 | C22.1 37.3,30.96 36.42,30.96 v36.41,30.95 | R14.1 36.63,49.47 34.33,47.17 C3.2 31.6,47.21 U5.4 29.04,46.58 28.56,46.11 R10.1
  pour Top (hatched): -0.27,56.86 -0.16,-0.71 66.96,-0.23 66.78,56.86
  pour Bottom (hatched): 0.21,56.5 66.93,57.17 67.17,-0.4 -0.14,-0.98 -0.42,12.32 -0.42,12.82 5.81,12.84 5.68,23.38 -0.65,23.38 -0.65,23.6
GND1  (via drill 0.6)
  Top 0.305: L2.1 7.19,8.4 v6.53,7.74
  Bottom 0.305: X1.S2 X1.S6 | X1.P5 1.74,19.71 X1.S6 | X1.S6 X1.S5 X1.S1 | 3.24,14.88 X1.P$4 1.56,14.96 1.51,14.96 X1.S1 | 3.24,14.88 X1.P$1 4.16,15.91 | v6.53,7.74 5.79,7.74 4.24,9.29 4.24,13.88 3.24,14.88 | 4.16,20.86 X1.S4 | 4.16,20.86 X1.P$7 | 4.16,20.86 X1.P$8 4.05,21.08 2.41,21.08 1.69,21.8 X1.P$5 1.66,21.86 X1.S2 | 4.16,15.91 X1.S3 | 4.16,15.91 X1.P$2 | X1.P$3 1.21,14.91 1.31,15.01 X1.S1 | X1.S2 1.56,21.76 X1.P$6
  pour Bottom (hatched): -1.13,22.71 4.98,22.71 4.98,13.9 -1.01,13.9 -1.01,15.24
GPIO-4
  Top 0.305: U1.P$29 42.57,23.12 41.93,23.75 41.93,24.22 41.74,24.42 41,24.42 R6.1
GPIO-6
  Top 0.305: R7.1 40.9,27.14 43.65,27.14 U1.P$27
HWB
  Top 0.305: U8.33 22.19,26.76 21.66,27.29 21.66,31.01 R12.2
IO0
  Top 0.305: U8.31 23.19,36.13 16.37,42.95 5.77,42.95 IDC.11
IO1
  Top 0.305: U8.32 22.69,34.94 16,41.63 4.64,41.63 3.37,42.9 IDC.12
IO2
  Top 0.305: IDC.13 17.21,45.44 24.19,38.46 U8.29
IO3
  Top 0.305: U8.30 23.69,37.15 16.7,44.13 4.49,44.13 IDC.14
MISO  (via drill 0.6)
  Top 0.305: ICSP.1 33.92,7.66 | 33.92,7.66 33.92,12.64 33.91,12.64 27.92,18.62 27.42,18.62 27.19,18.86 U8.11 | v62.1,20.09 60,20.09 59.65,19.74 47.5,19.74 v47.15,20.09 | v35.58,8.54 34.79,8.54 33.92,7.66
  Bottom 0.305: v62.1,20.09 63,19.19 64.5,19.19 SD1.7 | v35.58,8.54 35.94,8.54 37.38,9.98 38.14,9.98 43.89,15.73 43.89,16.84 v47.15,20.09
MOSI  (via drill 0.6)
  Top 0.305: U8.10 26.69,18.49 27.24,17.93 27.74,17.93 32.6,13.07 32.6,4.49 | ICSP.4 32.17,3.19 32.6,3.63 32.6,4.49 | v56.45,12.09 42.05,12.09 34.45,4.49 32.6,4.49
  Bottom 0.305: v56.45,12.09 59.1,14.74 SD1.3
N$1
  Top 0.406: Q1.1 39.37,53.52 D2.C
N$2  (via drill 0.6)
  Top 0.305: v34.1,19.39 34.1,18.89 35.85,17.14 36.35,17.14 v37.55,15.94 | TX_USB.C 18.05,4.29 19.07,4.29 19.59,3.77 v19.59,3.13 v19.58,3.12
  Bottom 0.305: v34.1,19.39 31.8,19.39 31.2,19.99 31.2,20.99 30.55,21.64 30.55,28.84 30.15,29.24 29.3,29.24 R15.2 | v19.58,3.12 v19.59,3.13 19.59,4.01 20.12,4.55 21.94,4.55 23.47,3.02 26.28,3.02 27.65,4.39 28.3,4.39 28.35,4.44 29.3,4.44 30.1,5.24 30.1,6.19 30.9,6.99 32.3,6.99 32.36,7.05 32.37,7.05 34.88,9.55 35.7,9.55 35.76,9.62 35.79,9.62 36.67,10.49 36.67,15.06 v37.55,15.94
N$3
  Bottom 0.406: D4.A 60.05,52.24 PANEL.1
N$4
  Top 0.406: RX_USB.C 13.74,4.31 R16.2
N$5
  Top 0.305: U8.7 25.19,16.54 27.05,14.68 D8.C
N$6  (via drill 0.6)
  Top 0.305: v45.75,15.19 44.85,16.09 42.45,16.09 41.85,15.5 41.85,14.85 41.07,14.07 40.67,14.07 39.13,15.62 39.13,23.54 39.85,24.25 39.85,27.84 40.15,28.14 40.2,28.14 40.85,28.79 R7.2 | v20.95,3.24 21.05,3.24 22.1,4.29 ASSOC..A
  Bottom 0.305: v45.75,15.19 45.25,15.19 38.55,8.49 38.15,8.49 35.2,5.54 35.2,5.24 34.4,4.44 30.85,4.44 30.1,3.69 30.1,2.69 29.35,1.94 22.25,1.94 v20.95,3.24
N$7
  Bottom 0.305: U2.7 42.41,33.5 R3.1
N$8  (via drill 0.6)
  Top 0.305: v27.65,8.59 27.15,8.59 26.05,7.49 25.3,7.49 24.2,6.39 24.2,4.34 CONNEC..A | R6.2 40.39,22.74 39.98,22.32 39.98,16.5 v40.85,15.64 | v37.72,11.12 35.12,11.12 v34.9,11.35
  Bottom 0.305: 40.85,15.89 v40.85,15.64 40.96,15.52 40.96,14.18 37.91,11.12 v37.72,11.12 | v27.65,8.59 30.19,8.59 30.53,8.94 32,8.94 34.16,11.1 34.64,11.1 v34.9,11.35
N$9
  Bottom 0.406: U5.6 20.73,48.48 C9.1
N$13
  Top 0.305: R8.2 36.46,38.63 U7.5
N$16
  Bottom 0.406: Y1.1 34.1,29.45 34.1,30.43 36.4,32.73 U2.1
N$17
  Bottom 0.406: U2.2 34.33,33.5 Y1.2
N$18
  Bottom 0.305: D7.C 40.07,39.93 41.87,41.73 54.2,41.73 | 54.2,41.73 57.85,41.73 P1.+$2 | 54.2,41.73 54.2,32.59 55.8,30.99 56.7,30.99 58,29.69 58,25.24 P1.+$1
  Bottom 0.406: D7.C 39.36,37.99 38.15,36.79 38.15,34.76 37.52,34.13 36.42,34.13 U2.3
N$20
  Top 0.305: POWER.A 6.98,52.4 R20.1
N$47
  Top 0.406: U4.1 50.52,51.48 51.09,50.91 C10.1
N$54
  Top 0.406: C10.2 49.9,48.1 49.1,47.31 49.1,46.29 U4.8 49.05,44.06 D5.C 49.8,42.63 50.75,41.68 58.25,41.68 L1.1
P_LEVEL  (via drill 0.6)
  Top 0.305: U8.28 24.69,39.63 v22.63,41.69
  Bottom 0.305: R23.2 18.76,43.22 R17.1 18.74,43.2 18.74,42.37 19.43,41.69 v22.63,41.69
PD0  (via drill 0.6)
  Top 0.305: v31.47,39.6 31.82,39.6 R8.1
  Bottom 0.305: v31.47,39.6 30.94,39.07 30.94,39.08 R24.2 24.31,39.07 U3.8
PD1
  Bottom 0.305: 16.7,40.11 U3.5
RD+  (via drill 0.6)
  Top 0.305: U8.4 23.69,17.62 v22.38,16.31
  Bottom 0.305: R5.2 11.9,16.39 12.7,16.39 13.34,17.03 14.46,17.03 15.85,15.63 16.73,15.62 21.45,15.62 v22.38,16.31
RD-  (via drill 0.6)
  Top 0.305: U8.3 23.19,18 22.58,17.39 21.67,17.39 21.36,17.08 21.36,14.77 20.82,14.24 20.82,12.88 20.2,12.25 20.2,11.48 v20.1,11.69
  Bottom 0.305: R4.2 18.32,14.13 20.2,12.25 20.2,11.48 v20.1,11.69
RESET  (via drill 0.6)
  Top 0.305: U1.P$5 63.65,19.09 45.8,19.09 44.85,18.14 42.43,18.14 41.41,19.17 v41.41,21.34 | U8.13 28.66,20.65 28.97,20.33 28.97,19.62 30.03,18.56 31.05,17.53 v31.34,17.53 32.73,16.14 v32.73,16.1 | ICSP.5 28.83,6.43 30.08,7.68 30.08,10.94 v29.99,11.03 | v12.3,17.74 13.7,17.74 14.09,17.35 v14.09,15.82 | RST.2 2.06,25.15 3.28,26.36 9.3,26.36 R11.2 | D6.A 8.86,26.8 R11.2 | v9.2,20.84 9.2,22.22 8.84,22.58 8.84,25.87 R11.2
  Bottom 0.305: v12.3,17.74 v9.2,20.84 | v31.34,17.53 31.34,17.58 32.16,18.4 32.17,18.39 34.5,18.39 34.55,18.44 40.47,18.44 41.41,19.37 v41.41,21.34 | v14.09,15.82 14.56,15.85 15.42,14.99 22.67,14.96 23.99,14.96 26.11,12.85 27.41,12.85 28.33,11.93 28.33,11.27 28.58,11.02 v29.99,11.02 v29.99,11.03 | 30.17,11.2 v29.99,11.03 | v32.73,16.1 32.73,12.64 31.09,11.01 30.01,11.01 v29.99,11.03
RXLED
  Top 0.305: U8.8 25.69,17.04 27.2,15.53 27.91,15.53 29.92,13.53 29.92,12.31 28.69,11.08 28.69,10.32 28.17,9.81 27.49,9.81 27.2,9.52 26.47,8.78 26.46,8.78 26.02,8.34 24.87,8.34 22.68,6.15 12.89,6.15 11.83,5.1 | 11.83,5.14 11.83,5.1 | 11.83,5.1 11.83,3.34 12.84,2.34 13.47,2.34 R16.1
RXWIFI  (via drill 0.6)
  Top 0.305: U8.20 29.69,24.15 31.29,25.75 32.56,25.75 33.7,26.88 v33.7,27.59 | v57,29.29 62.8,35.09 63.65,35.09 U1.P$13 | v53.85,26.14 53.35,26.14 49.7,22.49 45.95,22.49 v45.4,23.04
  Bottom 0.305: v53.85,26.14 v57,29.29 | v45.4,23.04 37.85,23.04 33.7,27.19 v33.7,27.59
S0
  Top 0.305: U8.40 17.52,22.15 14.95,24.71 14.95,30.37 12.58,32.75 IDC.3
S1
  Top 0.305: U8.41 17.09,21.65 14.33,24.41 14.33,29.33 12.21,31.45 4.48,31.45 IDC.4
S2
  Top 0.305: U8.38 18.26,23.15 16.08,25.33 16.08,32.95 13.76,35.27 IDC.5
S3
  Top 0.305: U8.39 17.86,22.65 15.53,24.98 15.53,31.53 13.03,34.03 4.44,34.03 IDC.6
S4
  Top 0.305: U8.36 18.87,24.15 17.34,25.68 17.34,34.93 14.46,37.8 5.75,37.8 IDC.7
S5
  Top 0.305: IDC.8 3.19,37.3 3.88,36.6 3.94,36.55 14.43,36.55 16.7,34.27 16.7,25.54 18.6,23.65 U8.37
SCK  (via drill 0.6)
  Top 0.305: U8.9 26.19,18.12 27.05,17.26 27.44,17.26 31.47,13.22 31.47,5.82 ICSP.3 | v49.2,20.74 v59.25,20.74
  Bottom 0.305: v59.25,20.74 59.25,20.64 62.9,16.99 64.5,16.99 SD1.5 | ICSP.3 31.4,5.74 32.15,5.74 33.4,6.99 35.69,6.99 38.07,9.37 38.52,9.37 44.78,15.63 44.78,16.33 v49.2,20.74
SCL  (via drill 0.6)
  Top 0.305: U8.18 30.37,23.15 31.13,23.91 31.13,23.93 31.78,24.57 34.15,24.57 35.25,25.68 35.4,25.74 v37.4,25.74 | v46.55,25.79 52.1,25.79 53.41,27.11 | 53.41,27.11 54,27.69 60.75,27.69 62.3,26.14 64.85,26.14 65.15,26.44 65.15,42.34 62.7,44.79 v50.05,44.79 | v25.45,51.09 v26.9,52.54 | v14,51.09 14,51.44 12.85,52.59 v12.85,52.89 | v4.8,51.09 4.55,51.09 1.95,48.49 1.95,41.59 3.15,40.39 IDC.10 | v47.16,34.24 47.16,33.88 50.13,30.91 52.9,30.91 v53.56,30.26 | v52.65,27.57 52.95,27.57 53.41,27.11
  Bottom 0.305: U3.2 15.03,38.57 14.45,39.14 9.15,39.14 | 9.15,39.14 4.41,39.14 IDC.10 | U2.6 45,34.15 R1.1 47.04,34.11 v47.16,34.24 | 9.15,39.14 9.15,27.79 8.4,27.04 7.6,27.04 U6.6 | v37.4,25.74 46.5,25.74 v46.55,25.79 | v50.05,44.79 46.15,44.79 36.45,54.49 28.85,54.49 v26.9,52.54 | v25.45,51.09 25.2,51.09 24.15,52.14 14.65,52.14 14,51.49 v14,51.09 | v12.85,52.89 6.6,52.89 v4.8,51.09 | v53.56,30.26 53.56,28.48 v52.65,27.57
SDA  (via drill 0.6)
  Top 0.305: U8.19 29.97,23.65 31.53,25.21 33.33,25.21 34.07,25.94 34.2,25.99 v35.25,27.04 | 45.8,34.14 45.8,33.84 48.5,31.14 48.5,29.94 47.85,29.29 45.95,29.29 45.4,28.74 v45.4,27.04 | 45.8,34.14 v45.8,35.29 | v26.05,41.19 v21.85,45.39 | v32.65,43.79 v32.65,40.69 | v40.2,43.79 40.2,42.04 42.2,40.04 42.2,34.39 42.45,34.14 45.8,34.14
  Bottom 0.305: U3.3 15.76,39.07 14.46,40.37 | 14.46,40.37 IDC.9 5.6,40.44 4.45,41.59 2.65,41.59 1.95,40.89 1.95,37.29 2.65,36.59 6.15,36.59 7.55,35.19 7.55,28.34 U6.5 | U2.5 43.61,34.8 44.11,35.29 v45.8,35.29 | v45.8,35.29 R2.1 | v35.25,27.04 v45.4,27.04 | v45.8,35.29 | v21.85,45.39 16.15,45.39 14.55,43.79 14.55,40.49 14.46,40.37 | v26.05,41.19 28.8,41.19 29.3,40.69 v32.65,40.69 | v32.65,43.79 33.95,43.79 34.15,43.59 40,43.59 v40.2,43.79
SLEEP  (via drill 0.6)
  Top 0.305: U8.25 26.19,27.99 27.2,29.01 36.8,29.01 v37.31,28.5 | U1.P$9 63.49,26.94 62.36,26.94 60.98,28.33 60.97,28.32 55.8,28.32 55.46,28.65 51.75,28.65 51.42,28.33 v46.38,28.33
  Bottom 0.305: v37.31,28.5 46.2,28.5 v46.38,28.33
TXLED  (via drill 0.6)
  Top 0.305: U8.22 27.96,25.84 28.24,26.12 29.12,26.12 v29.14,26.14
  Bottom 0.305: R15.1 29.25,26.25 v29.14,26.14
TXWIFI  (via drill 0.6)
  Top 0.305: U8.21 29.34,24.65 30.89,26.2 30.89,26.21 31.16,26.48 31.89,26.48 32.22,26.82 v32.25,26.79 | v60.3,29.94 63.45,33.09 63.65,33.09 U1.P$12 | v60.3,26.69 55.8,26.69 50.85,21.74 45.7,21.74 v45.4,21.44
  Bottom 0.305: v60.3,26.69 v60.3,29.94 | v32.25,26.79 32.68,26.79 37.16,22.31 44.53,22.31 v45.4,21.44
UCAP
  Top 0.305: U8.6 24.67,15.62 24.99,15.3 25.42,15.3 25.7,15.02 25.7,12.45 25.19,11.93 24.47,11.93 C12.1
UGND  (via drill 0.6)
  Top 0.305: U8.5 24.18,14.49 24.17,13.93 | 24.17,13.93 C12.2 | v10.95,21.19 6.6,16.84 6.6,15.06 6.98,14.68 | v32.2,20.39 32.2,19.19 34.35,17.04 v34.35,16.34 | v25.7,6.49 26.92,6.49 v27.63,7.2 | 24.17,13.93 22.17,13.93 21.76,13.52 21.76,12.27 v21.72,12.23 | 8.03,14.64 6.43,14.64 6.09,14.3 6.09,8.97 5.05,7.92 v5.05,6.99
  Top 0.406: JMP1.1 8.03,14.64
  Bottom 0.305: v10.95,21.19 19.15,21.19 28.2,30.24 30.05,30.24 31.25,29.04 31.25,21.84 32.2,20.89 v32.2,20.39 | v5.05,6.99 5.5,6.99 6.85,5.64 24.85,5.64 v25.7,6.49 | 35.85,12.62 35.85,12.54 | v27.63,7.2 27.73,7.3 29.97,7.3 30.78,8.11 32.35,8.11 34.44,10.19 35.26,10.19 35.82,10.75 35.82,12.6 35.85,12.62 | v21.72,12.23 21.81,12.14 26.99,12.14 27.44,11.69 27.44,10.01 27.95,9.5 29.96,9.5 30.43,9.97 31.83,9.97 33.6,11.73 33.6,15.59 v34.35,16.34 35.85,14.84 35.85,12.62
VBAT  (via drill 0.6)
  Top 0.305: 22.78,48.74 BAT.2
  Top 0.406: C5.1 38.4,34.36 U7.3 38.5,36.24 38.5,37.14 39.8,38.44 v39.8,41.04 | 22.78,48.74 22.78,46.14 23.47,45.45 23.51,45.45 23.67,45.29 26.99,45.29 27.26,45.01 28.77,45.01 | Q1.3 36.83,49.46 35.33,47.95 29.92,47.95 28.95,46.98 28.95,45.2 28.77,45.01 | R22.2 29.58,41.58 v29.7,41.69 29.68,41.71 29.68,43.99 28.77,44.9 28.77,45.01
  Bottom 0.406: v39.8,41.04 33.75,41.04 33.05,41.74 29.75,41.74 v29.7,41.69
VBAT_LEVEL
  Top 0.305: R22.1 R19.2 26.96,36.69 26.12,36.69 25.19,35.75 U8.27
VCC  (via drill 0.6)
  Top 0.305: C21.1 20.29,27.35 21.38,26.26 | 21.38,26.26 21.38,25.18 U8.34 | U8.2 22.69,18.29 22.32,17.93 21.35,17.93 20.68,17.27 20.68,15.85 | 20.68,15.85 20.68,15.06 20.2,14.57 20.2,13.37 18.87,12.04 L3.1 | TX_USB.A 19.79,2.21 21,1 31.72,1 ICSP.2 | U8.14 29.94,21.15 30.59,20.49 v30.59,19.34 v30.6,19.33 | 20.68,15.85 20.39,15.56 18.36,15.56 18,15.92 v18,17.4 | 21.38,26.26 20.61,26.26 v20.48,26.13 | D6.C 11.76,27.1 R11.1 11.01,24.71 v9.94,23.63
  Top 0.406: C18.1 10.55,11.32 11.51,10.36 11.51,9.54 | 11.51,9.54 11.51,6.33 11.16,5.98 10.05,5.98 | 10.05,5.98 9.37,5.98 R13.1 | TX_USB.A RX_USB.A 15.94,2.04 15.03,1.12 11.09,1.12 10.62,1.59 10.62,5.42 10.05,5.98 | L3.1 15.59,11.07 14.79,10.27 12.23,10.27 11.51,9.54 | U1.P$21 47.7,37.14 49.65,37.14 U1.P$20 49.66,35.39 50.07,34.99 50.68,34.99 51.04,34.63 51.04,33.67 v51.02,33.66 | v25.6,48.19 27.55,46.24 v27.55,46.19 | v17.9,38.29 v15.55,40.64 | v27.65,31.09 28.85,29.89 36.8,29.89 39.1,32.19 39.1,33.58 v39.17,33.66 39.16,33.67 39.16,34.64 39.37,34.85 R9.2
  Bottom 0.305: U3.1 17.73,38.07 18.23,37.56 C16.1 18.82,36.01 18.82,34.54 19.52,33.84 20.66,33.84 20.91,34.08 21.46,34.63 U3.10 | 18.85,24.54 18.89,24.54 | v9.94,23.63 9.94,23.79 9.19,24.54 | C15.2 6.58,22.83 7.53,23.78 7.53,24.46 U6.8
  Bottom 0.406: C11.1 18.1,50.99 R21.2 23.53,51 U5.8 U5.7 23.7,49.64 24.15,49.64 v25.6,48.19 | 60.72,17.82 48.55,29.99 48.55,30.74 46.5,32.79 | 60.72,17.82 62.65,15.89 64.5,15.89 SD1.4 | 46.5,32.79 46.4,32.89 45.92,32.41 R1.2 43.98,31.35 R3.2 42.13,31.35 41.2,32.28 | 21,31.09 21,33.99 20.91,34.08 | 18.85,24.54 9.19,24.54 7.7,24.54 U6.8 | v27.55,46.19 25.2,46.19 23.35,44.34 16.05,44.34 15.55,43.84 v15.55,40.64 | v17.9,38.29 17.8,38.19 17.73,38.07 | 21,31.09 v27.65,31.09 | 60.72,17.82 50.7,7.79 38.4,7.79 36.35,5.74 36.35,5.44 34.1,3.19 33.95,3.19 ICSP.2 | 46.5,32.79 46.58,32.88 48.9,32.88 49.29,33.26 R2.2 49.43,33.66 v51.02,33.66 | v18,17.4 18,17.64 18.24,17.64 22.07,21.46 28.47,21.46 v30.6,19.33 | U2.8 41.2,32.28 | 41.2,32.28 C22.2 39.87,31.61 39.17,32.31 v39.17,33.66 | 21,31.09 20.48,30.58 v20.48,26.13 18.89,24.54
VCHARGE
  Top 0.406: D3.C 42.5,47.2 40.8,45.5 39.45,45.5 Q1.8 Q1.7 38.13,45.38 38.13,44.04 38.4,43.77 C4.1 U7.4
VIN  (via drill 0.6)
  Top 0.406: v41.95,42.69 43.5,41.14 43.7,41.14 C13.1 | C20.1 48.09,43.17 47.85,43.41 47.85,46.18 U4.7 47.81,46.27 47.81,48.33 v48.22,48.74
  Bottom 0.406: 41.95,42.74 49.45,42.74 51.95,45.24 | 41.95,42.74 26.7,42.74 26.25,43.19 20.5,43.19 R17.2 | 51.95,45.24 51.95,45.36 | v41.95,42.69 41.95,42.74 | 52.06,45.36 51.95,45.24 | 52.06,45.36 51.58,45.36 50.36,46.58 48.81,46.58 48.22,47.17 v48.22,48.74 | 52.06,45.36 D4.C
VOUT  (via drill 0.6)
  Top 0.406: D1.C 34.4,46.58 Q1.5 | Q1.5 Q1.6 | v33.75,49.14 31.65,49.14 31.55,49.24 25.85,49.24 23.45,51.64 15.95,51.64 15.2,52.39 14.8,52.39 S1.3 | v34.55,44.59 35.35,45.39 Q1.5
  Bottom 0.406: v33.75,49.14 33.75,50.99 32.4,52.34 32.4,53.14 33.05,53.79 36.2,53.79 38.35,51.64 38.35,47.59 35.35,44.59 v34.55,44.59
VPANEL  (via drill 0.6)
  Top 0.406: L1.2 58.25,48.17 58.25,50.37 57.48,51.13 54.44,51.13 53.09,52.48 51.01,52.48 49.07,54.43 49.06,54.43 C7.+ 49.06,54.69 45.86,54.69 45.26,54.09 45.26,51.5 U4.4 45.19,51.53 D3.A 41.56,51.53 40.9,50.88 40.9,48.74 40.31,48.15 38.61,48.15 38.21,48.55 | 38.21,48.55 38.11,48.65 Q1.2 | v37.29,48 37.66,48 38.21,48.55
  Bottom 0.406: R10.2 30.27,45.06 30.85,45.65 34.94,45.65 v37.29,48
VPOWER  (via drill 0.6)
  Top 0.406: IDC.2 IDC.1 | v10.7,50.69 11.77,50.69 | v26.65,54.34 v28.95,52.04 | v12.55,54.49 12.55,54.04 11.8,53.29 11.8,52.54 S1.2 11.77,50.69 | 11.77,50.69 11.77,49.74 R20.2
  Bottom 0.406: C3.1 29.64,49.07 U5.3 U5.2 U5.1 28.95,51.19 v28.95,52.04 | v10.7,50.69 6.9,50.69 5.5,49.29 2.7,49.29 1.25,47.84 1.25,32.14 3.15,30.24 IDC.2 | v26.65,54.34 15.5,54.34 14.5,55.34 13.4,55.34 v12.55,54.49
VUSB  (via drill 0.6)
  Top 0.406: D1.A 35.32,50.38 Q1.4 35.62,50.67 D2.A | v33.43,52.75 33.43,51.27 D1.A | D1.A 27.53,50.38 v27.07,50.84 | v1.62,50.07 1.61,50.07 1.17,49.63 1.17,29.19 2.47,27.89 6.51,27.89 7.43,28.82 7.43,29.81 7.98,30.36 12.26,30.36 13.51,29.11 13.51,20.34 v13.97,19.88 | v25.5,10.04 25.65,10.04 D8.A 27.83,11.44 28.51,12.12 28.51,12.67 v28.79,12.95
  Bottom 0.305: 17.9,8.51 C19.2
  Bottom 0.406: F1.1 C8.2 17.84,8.57 C19.2 | R14.2 34.64,51.54 v33.43,52.75 | 25.46,10.08 v25.5,10.04 23.97,8.51 17.9,8.51 | v27.07,50.84 27.07,50.92 24.67,53.33 14.75,53.33 12.78,51.36 11.82,51.36 11.07,52.11 7.2,52.11 5.15,50.07 v1.62,50.07 | v13.97,19.88 13.97,18.67 14.23,18.4 16.36,16.27 20.4,16.27 21.16,17.03 21.17,17.03 21.77,17.63 25.95,17.63 26.8,16.78 26.8,13.99 27.2,13.59 28.15,13.59 v28.79,12.95
XTAL1
  Top 0.305: U8.17 31.15,22.65 31.82,23.31 32.41,23.31 R18.1 32.84,23.74 Y2.3
XTAL2
  Top 0.305: U8.16 31.24,22.15 31.84,21.55 32.35,21.55 R18.2 32.74,21.34 Y2.1
XUSB
  Bottom 0.305: X1.P1 4.86,17.06 5.24,16.68 5.24,15.44 5.33,15.35
  Bottom 0.406: 5.33,15.35 5.33,11.65 7.7,9.28 7.7,9.16 F1.2

### Text on the board
tPlace: + | + | + | 1
bPlace: SCK Base Board v1.1b | Designed in Barcelona | www.smartcitizen.me